# EAGLE design Solid State Timer v1.0 (EAGLE 7.7.0)

## Sheet 1 of 2
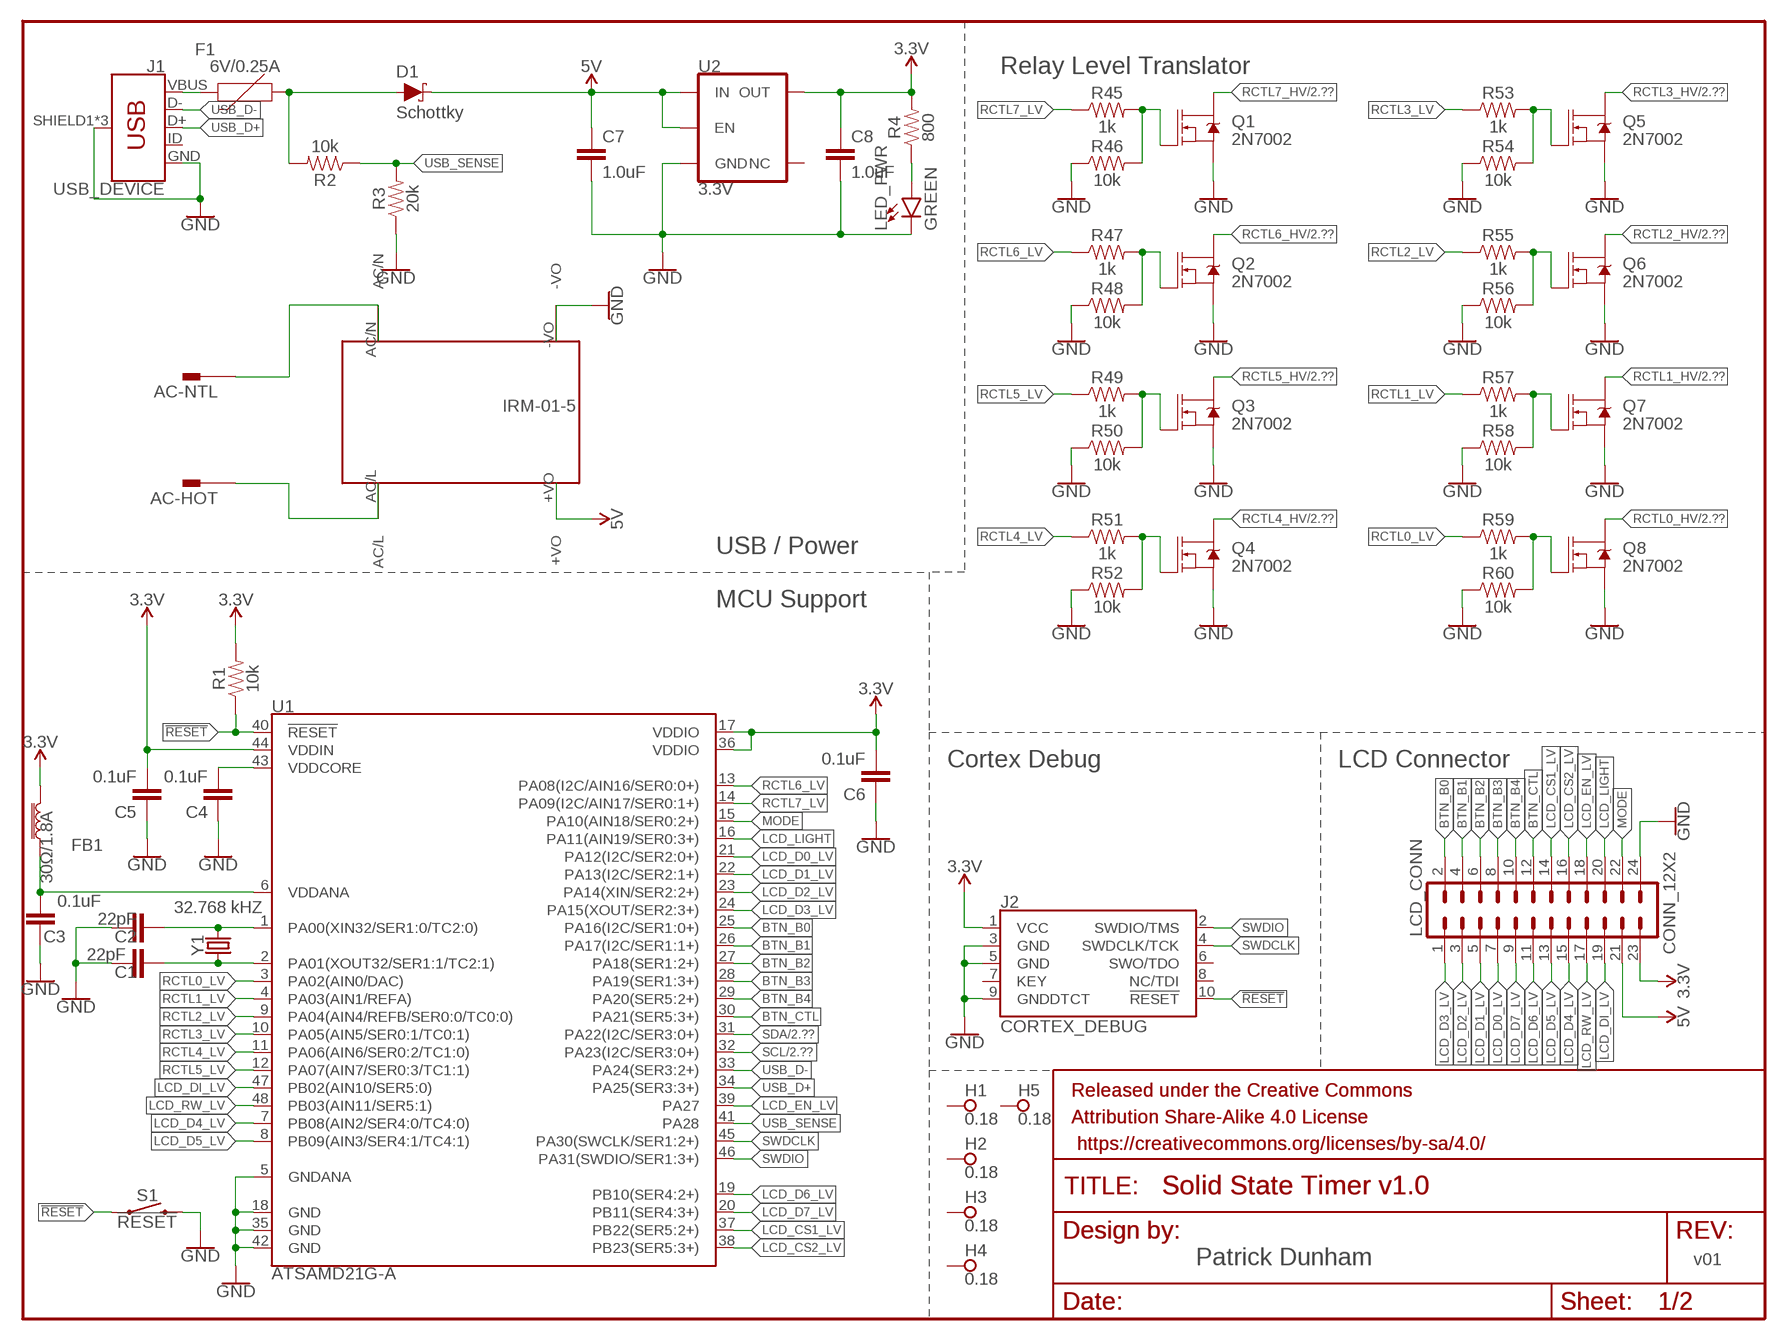
[diagram p0: schematic, sheet 1]

### Parts
AC-HOT  PIN262409-1  [62409-1]
AC-NTL  PIN262409-1  [62409-1]
C1  22pF  22PF-0603-50V-5%  [0603]
C2  22pF  22PF-0603-50V-5%  [0603]
C3  0.1uF  0.1UF-0603-25V-5%  [0603]
C4  0.1uF  0.1UF-0603-25V-5%  [0603]
C5  0.1uF  0.1UF-0603-25V-5%  [0603]
C6  0.1uF  0.1UF-0603-25V-5%  [0603]
C7  1.0uF  1.0UF-0603-16V-10%  [0603]
C8  1.0uF  1.0UF-0603-16V-10%  [0603]
D1  Schottky  DIODE-SCHOTTKY-ZLLS500  [SOT23-3]
F1  6V/0.25A  PPTC_THREE-QUARTER-AMP  [1206]
FB1  30Ω/1.8A  FERRITE_BEAD-0603  [0603]
FRAME1  FRAME-LETTERNO_PACKAGE  [DUMMY]
FRAME3  FRAME-LETTERNO_PACKAGE  [DUMMY]
H1  0.18  SPECIAL_DRILL_0.1800  [PAD_0.1800]
H2  0.18  SPECIAL_DRILL_0.1800  [PAD_0.1800]
H3  0.18  SPECIAL_DRILL_0.1800  [PAD_0.1800]
H4  0.18  SPECIAL_DRILL_0.1800  [PAD_0.1800]
H5  0.18  SPECIAL_DRILL_0.1800  [PAD_0.1800]
J1  USB_DEVICE  USB_MICRO-B_FEMALE-SMT  [USB-B-MICRO-SMD]
J2  CORTEX_DEBUG  CORTEX_DEBUG_PTH  [2X5-PTH-1.27MM]
LCD_CONN  CONN_12X2  [2X12]
LED_PWR  GREEN  LED0603  [LED-0603]
Q1  2N7002  MOSFET-NCH-2N7002PW  [SOT323]
Q2  2N7002  MOSFET-NCH-2N7002PW  [SOT323]
Q3  2N7002  MOSFET-NCH-2N7002PW  [SOT323]
Q4  2N7002  MOSFET-NCH-2N7002PW  [SOT323]
Q5  2N7002  MOSFET-NCH-2N7002PW  [SOT323]
Q6  2N7002  MOSFET-NCH-2N7002PW  [SOT323]
Q7  2N7002  MOSFET-NCH-2N7002PW  [SOT323]
Q8  2N7002  MOSFET-NCH-2N7002PW  [SOT323]
R1  10k  10KOHM-0603-1/10W-1%  [0603]
R2  10k  10KOHM-0603-1/10W-1%  [0603]
R3  20k  20KOHM-0603-1/10W-5%  [0603]
R4  800  330OHM-0603-1/10W-1%  [0603]
R45  1k  1KOHM-0603-1/10W-1%  [0603]
R46  10k  10KOHM-0603-1/10W-1%  [0603]
R47  1k  1KOHM-0603-1/10W-1%  [0603]
R48  10k  10KOHM-0603-1/10W-1%  [0603]
R49  1k  1KOHM-0603-1/10W-1%  [0603]
R50  10k  10KOHM-0603-1/10W-1%  [0603]
R51  1k  1KOHM-0603-1/10W-1%  [0603]
R52  10k  10KOHM-0603-1/10W-1%  [0603]
R53  1k  1KOHM-0603-1/10W-1%  [0603]
R54  10k  10KOHM-0603-1/10W-1%  [0603]
R55  1k  1KOHM-0603-1/10W-1%  [0603]
R56  10k  10KOHM-0603-1/10W-1%  [0603]
R57  1k  1KOHM-0603-1/10W-1%  [0603]
R58  10k  10KOHM-0603-1/10W-1%  [0603]
R59  1k  1KOHM-0603-1/10W-1%  [0603]
R60  10k  10KOHM-0603-1/10W-1%  [0603]
S1  !RESET  MOMENTARY-SWITCH-SPST-PTH-RIGHT-ANGLE-KIT  [TACTILE_SWITCH_PTH_RIGHT_ANGLE_KIT]
U1  ATSAMD21G-A  [TQFP-48]
U2  3.3V  V_REG_AP2112K-3.3V  [SOT23-5]
U$1  IRM-05-1  [IRM-01-5]
Y1  32.768 kHZ  CRYSTALSMD-3.2X1.5  [CRYSTAL-SMD-3.2X1.5MM]

### Nets
3.3V: C5.2 C6.2 C8.1 FB1.2 J2.1(VCC) LCD_CONN.23 R1.2 R4.2 U1.17(VDDIO) U1.36(VDDIO) U1.44(VDDIN) U2.5(OUT) ; also sheet 2
5V: C7.1 D1.3(C) LCD_CONN.21 U2.1(IN) U2.3(EN) U$1.+VO ; also sheet 2
!RESET: J2.10(!RESET) R1.1 S1.1 U1.40(!RESET!)
BTN_B0: LCD_CONN.2 U1.25(PA16(I2C/SER1:0+))
BTN_B1: LCD_CONN.4 U1.26(PA17(I2C/SER1:1+))
BTN_B2: LCD_CONN.6 U1.27(PA18(SER1:2+))
BTN_B3: LCD_CONN.8 U1.28(PA19(SER1:3+))
BTN_B4: LCD_CONN.10 U1.29(PA20(SER5:2+))
BTN_CTL: LCD_CONN.12 U1.30(PA21(SER5:3+))
GND: C1.1 C2.1 C3.1 C4.1 C5.1 C6.1 C7.2 C8.2 J1.GND J1.SHIELD1(SHIELD) J1.SHIELD2(SHIELD) J1.SHIELD3(SHIELD) J2.3(GND) J2.5(GND) J2.9(GNDDTCT) LCD_CONN.24 LED_PWR.C Q1.2(S) Q2.2(S) Q3.2(S) Q4.2(S) Q5.2(S) Q6.2(S) Q7.2(S) Q8.2(S) R3.1 R46.1 R48.1 R50.1 R52.1 R54.1 R56.1 R58.1 R60.1 S1.2 U1.5(GNDANA) U1.18(GND) U1.35(GND) U1.42(GND) U2.2(GND) U$1.-VO ; also sheet 2
LCD_CS1_LV: LCD_CONN.14 U1.37(PB22(SER5:2+))
LCD_CS2_LV: LCD_CONN.16 U1.38(PB23(SER5:3+))
LCD_D0_LV: LCD_CONN.7 U1.21(PA12(I2C/SER2:0+))
LCD_D1_LV: LCD_CONN.5 U1.22(PA13(I2C/SER2:1+))
LCD_D2_LV: LCD_CONN.3 U1.23(PA14(XIN/SER2:2+))
LCD_D3_LV: LCD_CONN.1 U1.24(PA15(XOUT/SER2:3+))
LCD_D4_LV: LCD_CONN.15 U1.7(PB08(AIN2/SER4:0/TC4:0))
LCD_D5_LV: LCD_CONN.13 U1.8(PB09(AIN3/SER4:1/TC4:1))
LCD_D6_LV: LCD_CONN.11 U1.19(PB10(SER4:2+))
LCD_D7_LV: LCD_CONN.9 U1.20(PB11(SER4:3+))
LCD_DI_LV: LCD_CONN.19 U1.47(PB02(AIN10/SER5:0))
LCD_EN_LV: LCD_CONN.18 U1.39(PA27)
LCD_LIGHT: LCD_CONN.20 U1.16(PA11(AIN19/SER0:3+))
LCD_RW_LV: LCD_CONN.17 U1.48(PB03(AIN11/SER5:1))
MODE: LCD_CONN.22 U1.15(PA10(AIN18/SER0:2+))
N$1: C2.2 U1.1(PA00(XIN32/SER1:0/TC2:0)) Y1.P$2
N$2: C1.2 U1.2(PA01(XOUT32/SER1:1/TC2:1)) Y1.P$1
N$3: C3.2 FB1.1 U1.6(VDDANA)
N$4: C4.2 U1.43(VDDCORE)
N$5: F1.2 J1.VBUS
N$6: AC-NTL.A1 AC-NTL.A2 U$1.AC/N
N$7: AC-HOT.A1 AC-HOT.A2 U$1.AC/L
N$9: LED_PWR.A R4.1
N$15: Q1.1(G) R45.2 R46.2
N$17: D1.1(A) F1.1 R2.2
N$44: Q2.1(G) R47.2 R48.2
N$67: Q3.1(G) R49.2 R50.2
N$68: Q4.1(G) R51.2 R52.2
N$69: Q5.1(G) R53.2 R54.2
N$70: Q6.1(G) R55.2 R56.2
N$71: Q7.1(G) R57.2 R58.2
N$72: Q8.1(G) R59.2 R60.2
RCTL0_HV: Q8.3(D) ; also sheet 2
RCTL0_LV: R59.1 U1.3(PA02(AIN0/DAC))
RCTL1_HV: Q7.3(D) ; also sheet 2
RCTL1_LV: R57.1 U1.4(PA03(AIN1/REFA))
RCTL2_HV: Q6.3(D) ; also sheet 2
RCTL2_LV: R55.1 U1.9(PA04(AIN4/REFB/SER0:0/TC0:0))
RCTL3_HV: Q5.3(D) ; also sheet 2
RCTL3_LV: R53.1 U1.10(PA05(AIN5/SER0:1/TC0:1))
RCTL4_HV: Q4.3(D) ; also sheet 2
RCTL4_LV: R51.1 U1.11(PA06(AIN6/SER0:2/TC1:0))
RCTL5_HV: Q3.3(D) ; also sheet 2
RCTL5_LV: R49.1 U1.12(PA07(AIN7/SER0:3/TC1:1))
RCTL6_HV: Q2.3(D) ; also sheet 2
RCTL6_LV: R47.1 U1.13(PA08(I2C/AIN16/SER0:0+))
RCTL7_HV: Q1.3(D) ; also sheet 2
RCTL7_LV: R45.1 U1.14(PA09(I2C/AIN17/SER0:1+))
SCL: U1.32(PA23(I2C/SER3:0+)) ; also sheet 2
SDA: U1.31(PA22(I2C/SER3:0+)) ; also sheet 2
SWDCLK: J2.4(SWDCLK/TCK) U1.45(PA30(SWCLK/SER1:2+))
SWDIO: J2.2(SWDIO/TMS) U1.46(PA31(SWDIO/SER1:3+))
USB_D+: J1.D+ U1.34(PA25(SER3:3+))
USB_D-: J1.D- U1.33(PA24(SER3:2+))
USB_SENSE: R2.1 R3.2 U1.41(PA28)
Unconnected: H1.1 H2.1 H3.1 H4.1 H5.1 J1.ID J2.6(SWO/TDO) J2.7(KEY) J2.8(NC/TDI) U2.4(NC)

### Notes on the sheet
- Relay Level Translator
- USB / Power
- MCU Support
- Cortex Debug | LCD Connector

## Sheet 2 of 2
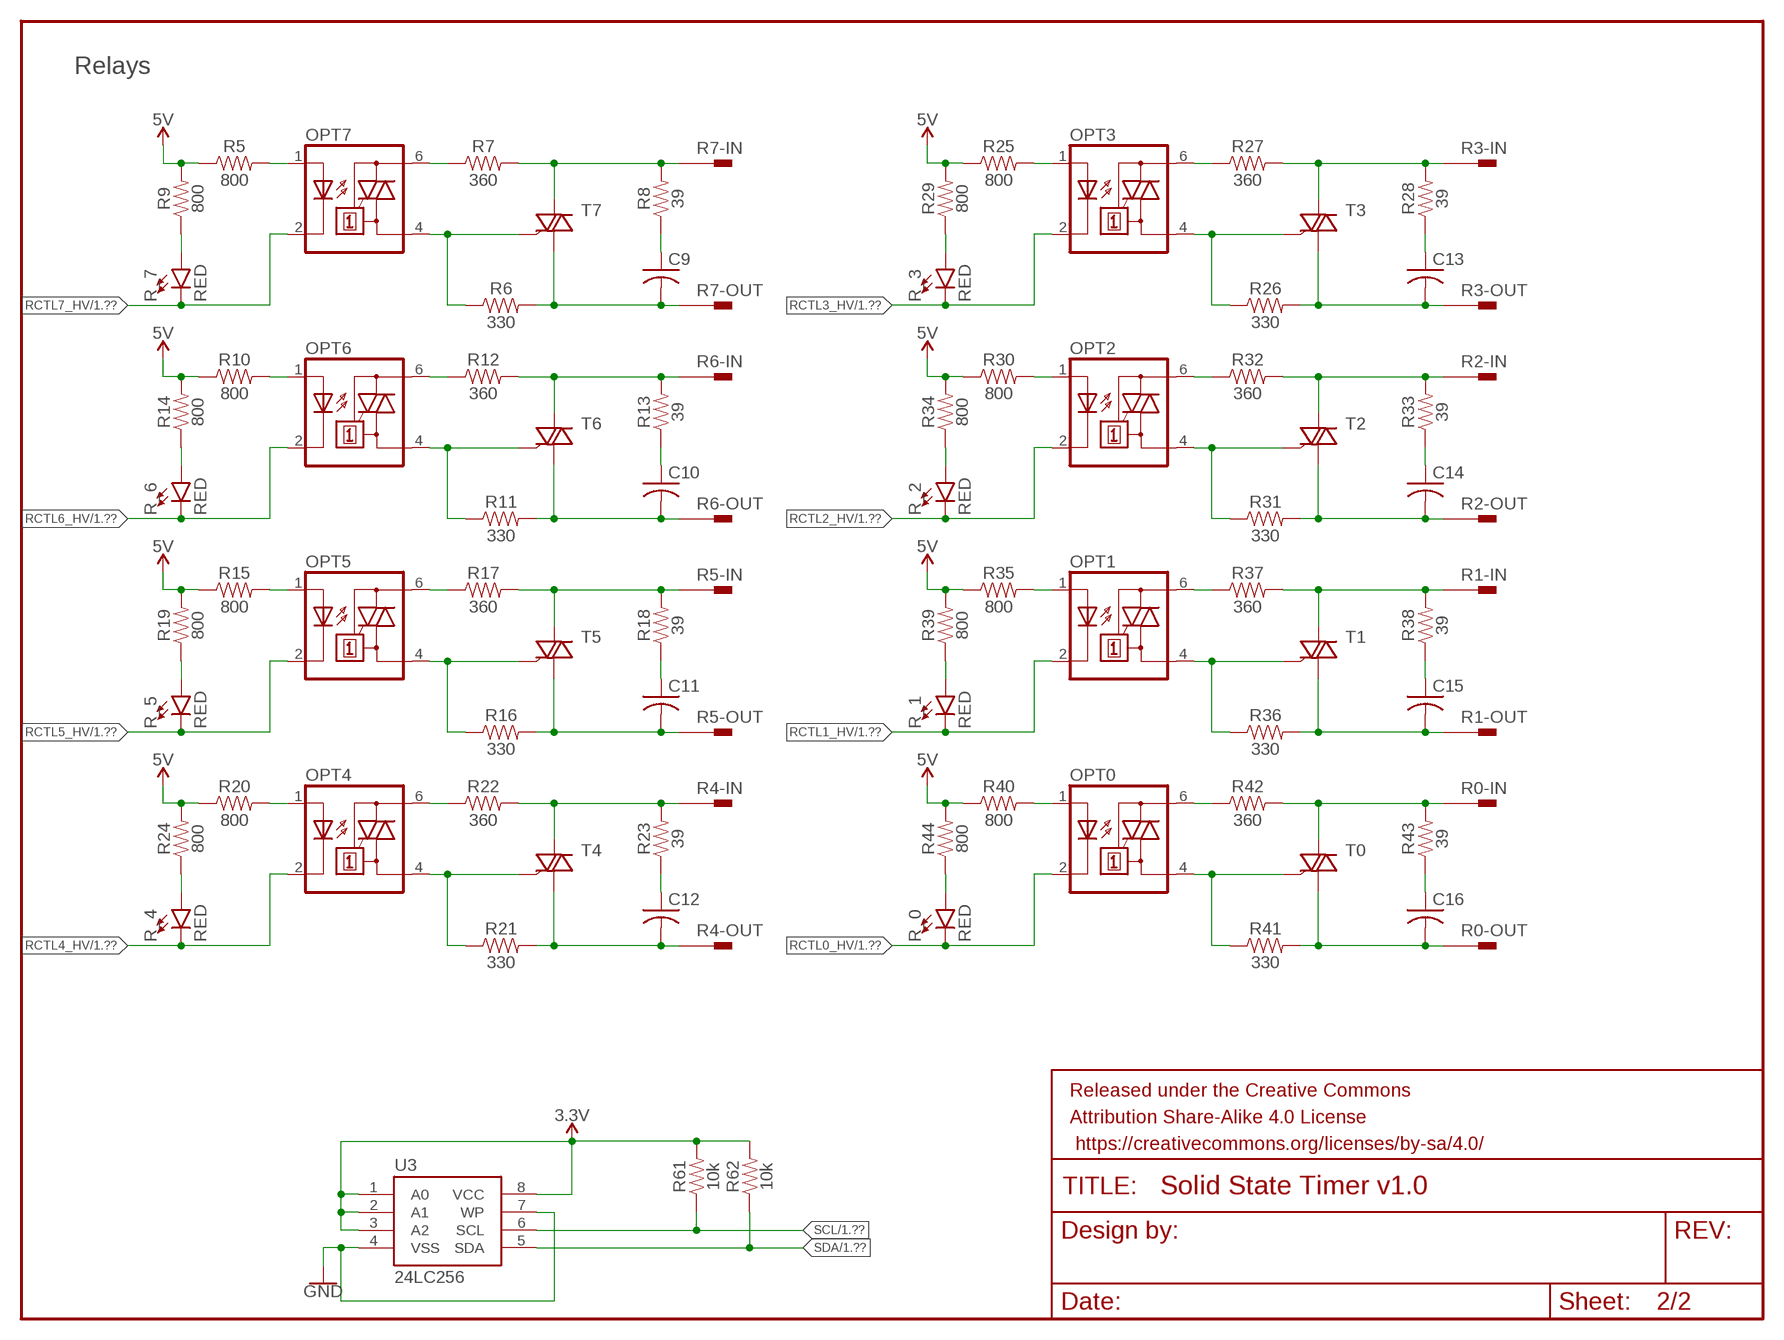
[diagram p1: schematic, sheet 2]

### Parts
C9  C-USC1206  [C1206]
C10  C-USC1206  [C1206]
C11  C-USC1206  [C1206]
C12  C-USC1206  [C1206]
C13  C-USC1206  [C1206]
C14  C-USC1206  [C1206]
C15  C-USC1206  [C1206]
C16  C-USC1206  [C1206]
FRAME2  FRAME-LETTERNO_PACKAGE  [DUMMY]
OPT0  MOC3031M  [DIL06]
OPT1  MOC3031M  [DIL06]
OPT2  MOC3031M  [DIL06]
OPT3  MOC3031M  [DIL06]
OPT4  MOC3031M  [DIL06]
OPT5  MOC3031M  [DIL06]
OPT6  MOC3031M  [DIL06]
OPT7  MOC3031M  [DIL06]
R0-IN  PIN262409-1  [62409-1]
R0-OUT  PIN262409-1  [62409-1]
R1-IN  PIN262409-1  [62409-1]
R1-OUT  PIN262409-1  [62409-1]
R2-IN  PIN262409-1  [62409-1]
R2-OUT  PIN262409-1  [62409-1]
R3-IN  PIN262409-1  [62409-1]
R3-OUT  PIN262409-1  [62409-1]
R4-IN  PIN262409-1  [62409-1]
R4-OUT  PIN262409-1  [62409-1]
R5  800  180OHM-0603-1/10W-1%  [0603]
R5-IN  PIN262409-1  [62409-1]
R5-OUT  PIN262409-1  [62409-1]
R6  330  330OHM-0603-1/10W-1%  [0603]
R6-IN  PIN262409-1  [62409-1]
R6-OUT  PIN262409-1  [62409-1]
R7  360  390OHM-0603-1/10W-1%  [0603]
R7-IN  PIN262409-1  [62409-1]
R7-OUT  PIN262409-1  [62409-1]
R8  39  39KOHM-0603-1/10W-1%  [0603]
R9  800  680OHM-0603-1/10W-5%  [0603]
R10  800  180OHM-0603-1/10W-1%  [0603]
R11  330  330OHM-0603-1/10W-1%  [0603]
R12  360  390OHM-0603-1/10W-1%  [0603]
R13  39  39KOHM-0603-1/10W-1%  [0603]
R14  800  680OHM-0603-1/10W-5%  [0603]
R15  800  180OHM-0603-1/10W-1%  [0603]
R16  330  330OHM-0603-1/10W-1%  [0603]
R17  360  390OHM-0603-1/10W-1%  [0603]
R18  39  39KOHM-0603-1/10W-1%  [0603]
R19  800  680OHM-0603-1/10W-5%  [0603]
R20  800  180OHM-0603-1/10W-1%  [0603]
R21  330  330OHM-0603-1/10W-1%  [0603]
R22  360  390OHM-0603-1/10W-1%  [0603]
R23  39  39KOHM-0603-1/10W-1%  [0603]
R24  800  680OHM-0603-1/10W-5%  [0603]
R25  800  180OHM-0603-1/10W-1%  [0603]
R26  330  330OHM-0603-1/10W-1%  [0603]
R27  360  390OHM-0603-1/10W-1%  [0603]
R28  39  39KOHM-0603-1/10W-1%  [0603]
R29  800  680OHM-0603-1/10W-5%  [0603]
R30  800  180OHM-0603-1/10W-1%  [0603]
R31  330  330OHM-0603-1/10W-1%  [0603]
R32  360  390OHM-0603-1/10W-1%  [0603]
R33  39  39KOHM-0603-1/10W-1%  [0603]
R34  800  680OHM-0603-1/10W-5%  [0603]
R35  800  180OHM-0603-1/10W-1%  [0603]
R36  330  330OHM-0603-1/10W-1%  [0603]
R37  360  390OHM-0603-1/10W-1%  [0603]
R38  39  39KOHM-0603-1/10W-1%  [0603]
R39  800  680OHM-0603-1/10W-5%  [0603]
R40  800  180OHM-0603-1/10W-1%  [0603]
R41  330  330OHM-0603-1/10W-1%  [0603]
R42  360  390OHM-0603-1/10W-1%  [0603]
R43  39  39KOHM-0603-1/10W-1%  [0603]
R44  800  680OHM-0603-1/10W-5%  [0603]
R61  10k  10KOHM-0603-1/10W-1%  [0603]
R62  10k  10KOHM-0603-1/10W-1%  [0603]
R_0  RED  LED-RED0603  [LED-0603]
R_1  RED  LED-RED0603  [LED-0603]
R_2  RED  LED-RED0603  [LED-0603]
R_3  RED  LED-RED0603  [LED-0603]
R_4  RED  LED-RED0603  [LED-0603]
R_5  RED  LED-RED0603  [LED-0603]
R_6  RED  LED-RED0603  [LED-0603]
R_7  RED  LED-RED0603  [LED-0603]
T0  BT138-V  [TO220BV]
T1  BT138-V  [TO220BV]
T2  BT138-V  [TO220BV]
T3  BT138-V  [TO220BV]
T4  BT138-V  [TO220BV]
T5  BT138-V  [TO220BV]
T6  BT138-V  [TO220BV]
T7  BT138-V  [TO220BV]
U3  24LC256  EEPROM-I2CSMD  [SO08]

### Nets
3.3V: R61.2 R62.2 U3.1(A0) U3.2(A1) U3.3(A2) U3.8(VCC) ; also sheet 1
5V: R5.1 R9.2 R10.1 R14.2 R15.1 R19.2 R20.1 R24.2 R25.1 R29.2 R30.1 R34.2 R35.1 R39.2 R40.1 R44.2 ; also sheet 1
GND: U3.4(VSS) U3.7(WP) ; also sheet 1
N$8: OPT7.1(A) R5.2
N$10: OPT7.4(A1) R6.1 T7.G
N$11: OPT7.6(A2) R7.1
N$12: R7-IN.A1 R7-IN.A2 R7.2 R8.2 T7.T2(A2)
N$13: C9.1 R8.1
N$14: C9.2 R6.2 R7-OUT.A1 R7-OUT.A2 T7.T1(A1)
N$16: R9.1 R_7.A
N$18: OPT6.1(A) R10.2
N$19: OPT6.4(A1) R11.1 T6.G
N$20: OPT6.6(A2) R12.1
N$21: R6-IN.A1 R6-IN.A2 R12.2 R13.2 T6.T2(A2)
N$22: C10.1 R13.1
N$23: C10.2 R6-OUT.A1 R6-OUT.A2 R11.2 T6.T1(A1)
N$24: R14.1 R_6.A
N$25: OPT5.1(A) R15.2
N$26: OPT5.4(A1) R16.1 T5.G
N$27: OPT5.6(A2) R17.1
N$28: R5-IN.A1 R5-IN.A2 R17.2 R18.2 T5.T2(A2)
N$29: C11.1 R18.1
N$30: C11.2 R5-OUT.A1 R5-OUT.A2 R16.2 T5.T1(A1)
N$31: R19.1 R_5.A
N$32: OPT4.1(A) R20.2
N$33: OPT4.4(A1) R21.1 T4.G
N$34: OPT4.6(A2) R22.1
N$35: R4-IN.A1 R4-IN.A2 R22.2 R23.2 T4.T2(A2)
N$36: C12.1 R23.1
N$37: C12.2 R4-OUT.A1 R4-OUT.A2 R21.2 T4.T1(A1)
N$38: R24.1 R_4.A
N$39: OPT3.1(A) R25.2
N$40: OPT3.4(A1) R26.1 T3.G
N$41: OPT3.6(A2) R27.1
N$42: R3-IN.A1 R3-IN.A2 R27.2 R28.2 T3.T2(A2)
N$43: C13.1 R28.1
N$45: R29.1 R_3.A
N$46: OPT2.1(A) R30.2
N$47: OPT2.4(A1) R31.1 T2.G
N$48: OPT2.6(A2) R32.1
N$49: R2-IN.A1 R2-IN.A2 R32.2 R33.2 T2.T2(A2)
N$50: C14.1 R33.1
N$51: C14.2 R2-OUT.A1 R2-OUT.A2 R31.2 T2.T1(A1)
N$52: R34.1 R_2.A
N$53: OPT1.1(A) R35.2
N$54: OPT1.4(A1) R36.1 T1.G
N$55: OPT1.6(A2) R37.1
N$56: R1-IN.A1 R1-IN.A2 R37.2 R38.2 T1.T2(A2)
N$57: C15.1 R38.1
N$58: C15.2 R1-OUT.A1 R1-OUT.A2 R36.2 T1.T1(A1)
N$59: R39.1 R_1.A
N$60: OPT0.1(A) R40.2
N$61: OPT0.4(A1) R41.1 T0.G
N$62: OPT0.6(A2) R42.1
N$63: R0-IN.A1 R0-IN.A2 R42.2 R43.2 T0.T2(A2)
N$64: C16.1 R43.1
N$65: C16.2 R0-OUT.A1 R0-OUT.A2 R41.2 T0.T1(A1)
N$66: R44.1 R_0.A
R3-OUT: C13.2 R3-OUT.A1 R3-OUT.A2 R26.2 T3.T1(A1)
RCTL0_HV: OPT0.2(C) R_0.C ; also sheet 1
RCTL1_HV: OPT1.2(C) R_1.C ; also sheet 1
RCTL2_HV: OPT2.2(C) R_2.C ; also sheet 1
RCTL3_HV: OPT3.2(C) R_3.C ; also sheet 1
RCTL4_HV: OPT4.2(C) R_4.C ; also sheet 1
RCTL5_HV: OPT5.2(C) R_5.C ; also sheet 1
RCTL6_HV: OPT6.2(C) R_6.C ; also sheet 1
RCTL7_HV: OPT7.2(C) R_7.C ; also sheet 1
SCL: R61.1 U3.6(SCL) ; also sheet 1
SDA: R62.1 U3.5(SDA) ; also sheet 1

### Notes on the sheet
- Relays

## Library data of the parts
AC-HOT AC-NTL R0-IN R0-OUT R1-IN R1-OUT R2-IN R2-OUT R3-IN R3-OUT R4-IN R4-OUT R5-IN R5-OUT R6-IN R6-OUT R7-IN R7-OUT = con-faston:PIN2: Flachstecker Typ Tyco/Electronics/AMP TAB, FASTON Printed Circuit Board Tabs Source: http://www.buerklin.com, http://catalog.tycoelectronics.com; OC_FARNELL: unknown; OC_NEWARK: unknown
C1 C2 = SparkFun-Capacitors:22PF: 22pF ceramic capacitors A capacitor is a passive two-terminal electrical component used to store electrical energy temporarily in an electric field.; PROD_ID: CAP-07876
C3-C6 = SparkFun-Capacitors:0.1UF: 0.1µF ceramic capacitors A capacitor is a passive two-terminal electrical component used to store electrical energy temporarily in an electric field.; PROD_ID: CAP-08604
C7 C8 = SparkFun-Capacitors:1.0UF: 1µF ceramic capacitors A capacitor is a passive two-terminal electrical component used to store electrical energy temporarily in an electric field.; PROD_ID: CAP-00868
C9-C16 = rcl:C-US: CAPACITOR, American symbol
D1 = SparkFun-DiscreteSemi:DIODE-SCHOTTKY: Schottky diode A Schottky diode is a semiconductor diode which has a low forward voltage drop and a very fast switching action.; PROD_ID: DIO-08411; VALUE: 700mA/40V/533mV
F1 = SparkFun-Fuses:PPTC: Resettable Fuse PPTC Resettable Fuse. Really a sort of resistor with a polymeric positive temperature coefficient whose resistance increases dramatically with an increase in temperature. When heated by the power passing through the resistance rises causing the current to be limited, protecting the circuit. This is achieved by the transition of the polymer from a crystalline to an amorphous state where the conductive carbon separates breaking the conductive pathways found in the cool crystalline structure. When a PPTC cools back down it resumes conducting letting the circuit turn back on. SparkFun Products: SparkFun RedBoard - Programmed with Arduino <https://www.sparkfun.com/products/12757> Pro Micro - 5V/16MHz <https://www.sparkfun.com/products/12640> Arduino Pro 328 - 5V/16MHz <https://www.sparkfun.com/products/10915> MP3 Trigger <https://www.sparkfun.com/products/13720>; PROD_ID: RES-11150; VALUE: 6V/0.75A
FB1 = SparkFun-Coils:FERRITE_BEAD: Ferrite Bead (blocks, cores, rings, chokes, etc.) Inductor with layers of ferrite used to suppress high frequencies. Often used to isolate high frequency noise. SparkFun Products: IOIO-OTG - V2.2 <https://www.sparkfun.com/products/13613> SparkFun SAMD21 Mini Breakout <https://www.sparkfun.com/products/13664> SparkFun 6 Degrees of Freedom Breakout - LSM6DS3 <https://www.sparkfun.com/products/13339> SparkFun SAMD21 Dev Breakout <https://www.sparkfun.com/products/13672>; PROD_ID: NDUC-07859
FRAME1 FRAME2 = SparkFun-Aesthetics:FRAME-LETTER: Schematic Frame - Letter Standard 8.5x11 US Letter frame; DESIGNER: Nobody; VERSION: v01
FRAME3 = SparkFun-Aesthetics:FRAME-LETTER: Schematic Frame - Letter Standard 8.5x11 US Letter frame; DESIGNER: Patrick Dunham; VERSION: v01
H1-H5 = special-drill:SPECIAL_DRILL_: Special drills
J1 = SparkFun-Connectors:USB_MICRO-B: USB Type Micro-B Connector Male/female and PTH/SMT variants SparkFun Products: SparkFun microB USB Breakout <https://www.sparkfun.com/products/12035> SparkFun USB microB Plug Breakout <https://www.sparkfun.com/products/10031> SparkFun ESP8266 Thing <https://www.sparkfun.com/products/13231>; PROD_ID: CONN-11752
J2 = SparkFun-Connectors:CORTEX_DEBUG: Cortex Debug Connector - 10 pin Supports JTAG debug, Serial Wire debug, and Serial Wire Viewer. PTH and SMD connector options available. General Connector Information <http://infocenter.arm.com/help/topic/com.arm.doc.faqs/attached/13634/cortex_debug_connectors.pdf> Products: PTH Connector <http://www.digikey.com/product-detail/en/cnc-tech/3220-10-0100-00/1175-1627-ND/3883661> -via Digi-Key SparkFun PSoc <https://www.sparkfun.com/products/13229> SparkFun T <https://www.sparkfun.com/products/13810>
LCD_CONN = SparkFun-Connectors:CONN_12X2: Multi connection point. Often used as Generic Header-pin footprint for 0.1 inch spaced/style header connections On any of the 0.1 inch spaced packages, you can populate with these: Break Away Headers - Straight <https://www.sparkfun.com/products/116> (PRT-00116) Break Away Male Headers - Right Angle <https://www.sparkfun.com/products/553> (PRT-00553) Female Headers <https://www.sparkfun.com/products/115> (PRT-00115) Break Away Headers - Machine Pin <https://www.sparkfun.com/products/117> (PRT-00117) Break Away Female Headers - Swiss Machine Pin <https://www.sparkfun.com/products/743> (PRT-00743)
LED_PWR = SparkFun-LED:LED: LED (Generic) Standard schematic elements and footprints for 5mm, 3mm, 1206, and 0603 sized LEDs. Generic LEDs with no color specified.
OPT0 OPT1-OPT7 = optocoupler:MOC30*: 6-Pin DIP Zero-Cross Optoisolators Triac Driver Output (250/400 Volt Peak) Source: Data sheet <http://www.fairchildsemi.com/ds/MO/MOC3031M.pdf> The old path of data sheet not more available 2013-05-06.; MF: FAIRCHILD SEMICONDUCTOR; MPN: MOC3031M; OC_FARNELL: 9875964; OC_NEWARK: 78K6089
Q1-Q8 = SparkFun-DiscreteSemi:MOSFET-NCH: N-channel MOSFETs Voltage controlled devices that allow control of high current outputs. SparkFun Products: SparkFun OpenScale <https://www.sparkfun.com/products/13261> SparkFun Digital Sandbox <https://www.sparkfun.com/products/12651> SparkFun Monster Moto Shield <https://www.sparkfun.com/products/10182> SparkFun MOSFET Power Controller <https://www.sparkfun.com/products/11214>; PROD_ID: TRANS-11151; VALUE: 310mA/60V/1.6Ω
R1 R2 R46 R48 R50 R52 R54 R56 R58 R60-R62 = SparkFun-Resistors:10KOHM: 10kΩ resistor A resistor is a passive two-terminal electrical component that implements electrical resistance as a circuit element. Resistors act to reduce current flow, and, at the same time, act to lower voltage levels within circuits. - Wikipedia; PROD_ID: RES-00824
R3 = SparkFun-Resistors:20KOHM: 20kΩ resistor A resistor is a passive two-terminal electrical component that implements electrical resistance as a circuit element. Resistors act to reduce current flow, and, at the same time, act to lower voltage levels within circuits. - Wikipedia; PROD_ID: RES-09231
R4 = SparkFun-Resistors:330OHM: 330Ω resistor A resistor is a passive two-terminal electrical component that implements electrical resistance as a circuit element. Resistors act to reduce current flow, and, at the same time, act to lower voltage levels within circuits. - Wikipedia; PROD_ID: RES-00818; VALUE: 330
R5 R10 R15 R20 R25 R30 R35 R40 = SparkFun-Resistors:180OHM: 180Ω resistor A resistor is a passive two-terminal electrical component that implements electrical resistance as a circuit element. Resistors act to reduce current flow, and, at the same time, act to lower voltage levels within circuits. - Wikipedia; PROD_ID: RES-08788; VALUE: 180
R6 R11 R16 R21 R26 R31 R36 R41 = SparkFun-Resistors:330OHM: 330Ω resistor A resistor is a passive two-terminal electrical component that implements electrical resistance as a circuit element. Resistors act to reduce current flow, and, at the same time, act to lower voltage levels within circuits. - Wikipedia; PROD_ID: RES-00818
R7 R12 R17 R22 R27 R32 R37 R42 = SparkFun-Resistors:390OHM: 390Ω resistor A resistor is a passive two-terminal electrical component that implements electrical resistance as a circuit element. Resistors act to reduce current flow, and, at the same time, act to lower voltage levels within circuits. - Wikipedia; PROD_ID: RES-07864; VALUE: 390
R8 R13 R18 R23 R28 R33 R38 R43 = SparkFun-Resistors:39KOHM: 39kΩ resistor A resistor is a passive two-terminal electrical component that implements electrical resistance as a circuit element. Resistors act to reduce current flow, and, at the same time, act to lower voltage levels within circuits. - Wikipedia; PROD_ID: RES-12377; VALUE: 39k
R9 R14 R19 R24 R29 R34 R39 R44 = SparkFun-Resistors:680OHM: 680Ω resistor A resistor is a passive two-terminal electrical component that implements electrical resistance as a circuit element. Resistors act to reduce current flow, and, at the same time, act to lower voltage levels within circuits. - Wikipedia; PROD_ID: RES-09333; VALUE: 680
R45 R47 R49 R51 R53 R55 R57 R59 = SparkFun-Resistors:1KOHM: 1kΩ resistor A resistor is a passive two-terminal electrical component that implements electrical resistance as a circuit element. Resistors act to reduce current flow, and, at the same time, act to lower voltage levels within circuits. - Wikipedia; PROD_ID: RES-07856
R_0 R_1-R_7 = SparkFun-LED:LED-RED: Red SMD LED Used in manufacturing of most products at SparkFun Packages: 0603 - SMD 0603 package [Product Link] <http://docs.avagotech.com/docs/AV02-0551EN> 0603 SMART - SMD 0603 SMART package ( more efficient and expensive)[Product Link] <http://www.osram-os.com/Graphics/XPic2/00077099_0.pdf> 1206 - SMD1206 package [Product Link] <https://www.sparkfun.com/datasheets/DevTools/LilyPad/Q150OVS4.pdff> SparkFun Products: Pro Mini 328 -5V <https://www.sparkfun.com/products/821> RedBoard <https://www.sparkfun.com/products/12757> IOIO-OTG <https://www.sparkfun.com/products/13613>; PROD_ID: DIO-00819
S1 = SparkFun-Switches:MOMENTARY-SWITCH-SPST: Momentary Switch (Pushbutton) - SPST Normally-open (NO) SPST momentary switches (buttons, pushbuttons). Variants PTH-12MM - 12mm square, through-hole Momentary Pushbutton Switch - 12mm Square <https://www.sparkfun.com/products/9190> (COM-09190) PTH-6.0MM, PTH-6.0MM-KIT - 6.0mm square, through-hole Mini Pushbutton Switch <https://www.sparkfun.com/products/97> (COM-00097) KIT package intended for soldering kit's - only one side of pads' copper is exposed. PTH-RIGHT-ANGLE-KIT - Right-angle, through-hole Right Angle Tactile Button <https://www.sparkfun.com/products/10791> - Used on SparkFun BigTime Watch Kit <https://www.sparkfun.com/products/11734> SMD-12MM - 12mm square, surface-mount Tactile Button - SMD (12mm) <https://www.sparkfun.com/products/12993> (COM-12993) Used on SparkFun PicoBoard <https://www.sparkfun.com/products/11888> SMD-4.5MM - 4.5mm Square Trackball Switch Used on SparkFun Blackberry Trackballer Breakout <https://www.sparkfun.com/products/13169> SMD-4.6MMX2.8MM - 4.60mm x 2.80mm, surface mount Used on SparkFun SAMD21 Mini Breakout <https://www.sparkfun.com/products/13664> SMD-5.2MM, SMD-5.2-REDUNDANT - 5.2mm square, surface-mount Mini Pushbutton Switch - SMD <https://www.sparkfun.com/products/8720> (COM-08720) Used on Arduino Pro Mini <https://www.sparkfun.com/products/11114> REDUNDANT package connects both switch circuits together SMD-6.0X3.5MM - 6.0 x 3.5mm, surface mount Momentary Reset Switch SMD <https://www.sparkfun.com/products/8229> (COM-08229) SMD-6.2MM-TALL - 6.2mm square, surface mount Tactile Button - SMD (6mm) <https://www.sparkfun.com/products/12992> Used on SparkFun Digital Sandbox <https://www.sparkfun.com/products/12651> SMD-RIGHT-ANGLE - Right-angle, surface mount Used on SparkFun Block for Intel® Edison - Arduino <https://www.sparkfun.com/products/13036>; PROD_ID: CONN-10672; SF_SKU: COM-10791
T0 T1-T7 = triac:BT138: TRIAC Source: http://www.semiconductors.philips.com BT138_SERIES_2.pdf
U1 = SparkFun-IC-Microcontroller:ATSAMD21G: Atmel SAMD21G SMART ARM-Based Microcontroller The Atmel ® | SMART ™ SAM D21 is a series of low-power microcontrollers using the 32-bit ARM ® Cortex ® -M0+ processor, and ranging from 32- to 64-pins with up to 256KB Flash and 32KB of SRAM. The SAM D21 devices operate at a maximum frequency of 48MHz and reach 2.46 CoreMark/MHz. They are designed for simple and intuitive migration with identical peripheral modules, hex compatible code, identical linear address map and pin compatible migration paths between all devices in the product series. All devices include intelligent and flexible peripherals, Atmel Event System for inter-peripheral signaling, and support for capacitive touch button, slider and wheel user interfaces. Datasheet <https://cdn.sparkfun.com/datasheets/Dev/Arduino/Boards/Atmel-42181-SAM-D21_Datasheet.pdf> SparkFun Products SparkFun SAMD21 Mini Breakout <https://www.sparkfun.com/products/13664> (DEV-13664) SparkFun SAMD21 Dev Breakout <https://www.sparkfun.com/products/13672> (DEV-13672); PROD_ID: IC-13064
U2 = SparkFun-IC-Power:V_REG_AP2112: AP2112 - 600mA CMOS LDO Regulator w/ Enable The AP2112 is CMOS process low dropout linear regulator with enable function, the regulator delivers a guaranteed 600mA (min.) continuous load current. Features Output Voltage Accuracy: ±1.5% Output Current: 600mA (Min.) Foldback Short Current Protection: 50mA Enable Function to Turn ON/OFF VOUT Low Dropout Voltage (3.3V): 250mV (Typ.) @IOUT=600mA Excellent Load Regulation: 0.2%/A (Typ.) Excellent Line Regulation: 0.02%/V (Typ.) Low Quiescent Current: 55μA (Typ.) Low Standby Current: 0.01μA (Typ.) Low Output Noise: 50μVRMS PSRR: 100Hz -65dB, 1kHz -65dB OTSD Protection Stable with 1.0μF Flexible Cap: Ceramic, Tantalum and Aluminum Electrolytic Operation Temperature Range: -40°C to 85°C ESD: MM 400V, HBM 4000V; PROD_ID: VREG-12457
U3 = SparkFun-IC-Memory:EEPROM-I2C: I2C EEPROMs, 24LC256 and others 24LC256 Series 256 kb I2C 2 Wire (32 k x 8 Bit) 2.5 V Serial EEPROM SMD - SOIC-8 Datasheet SparkFun Products SparkFun UDB5 - PIC UAV Development Board <https://www.sparkfun.com/products/11703> (GPS-11703); PROD_ID: IC-09714
U$1 = IRM-01-5:IRM-05-1
Y1 = SparkFun-Clocks:CRYSTAL: Crystals (Generic) These are passive quartz crystals, which can be used as a clock source for a microcontroller. Crystal's are two-terminal devices. They require external "load" capacitors to generate an oscillating signal.

## Board
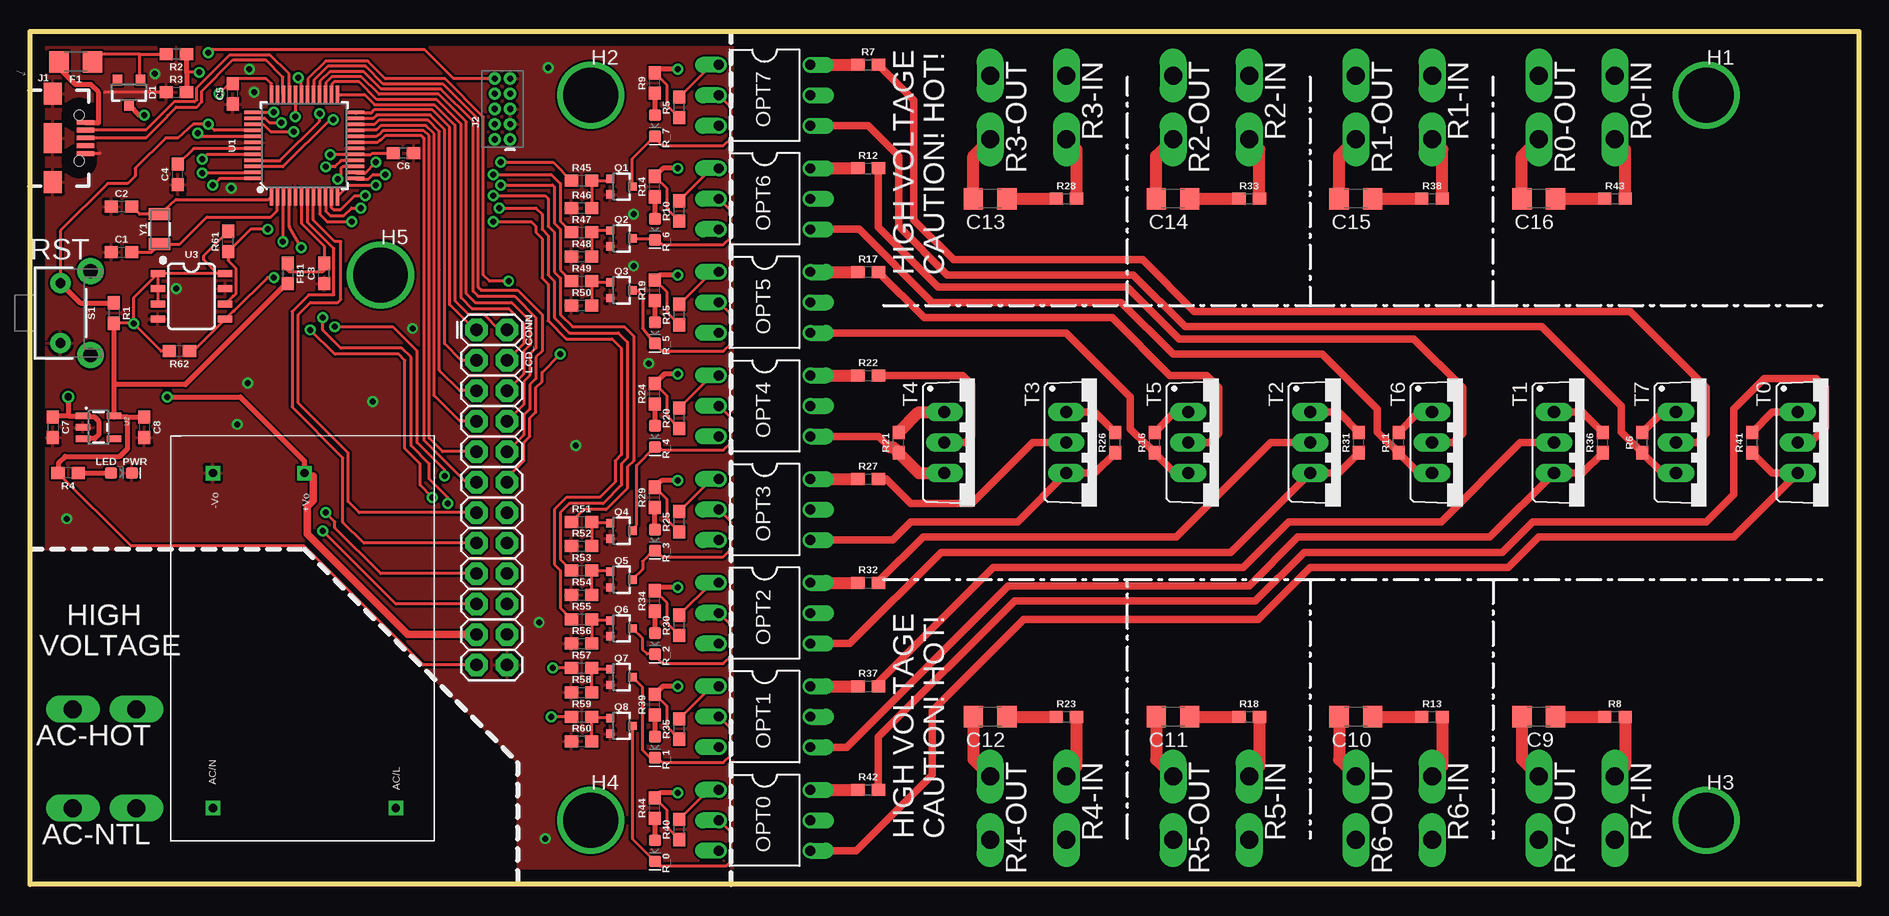
[diagram p2: board, top side]
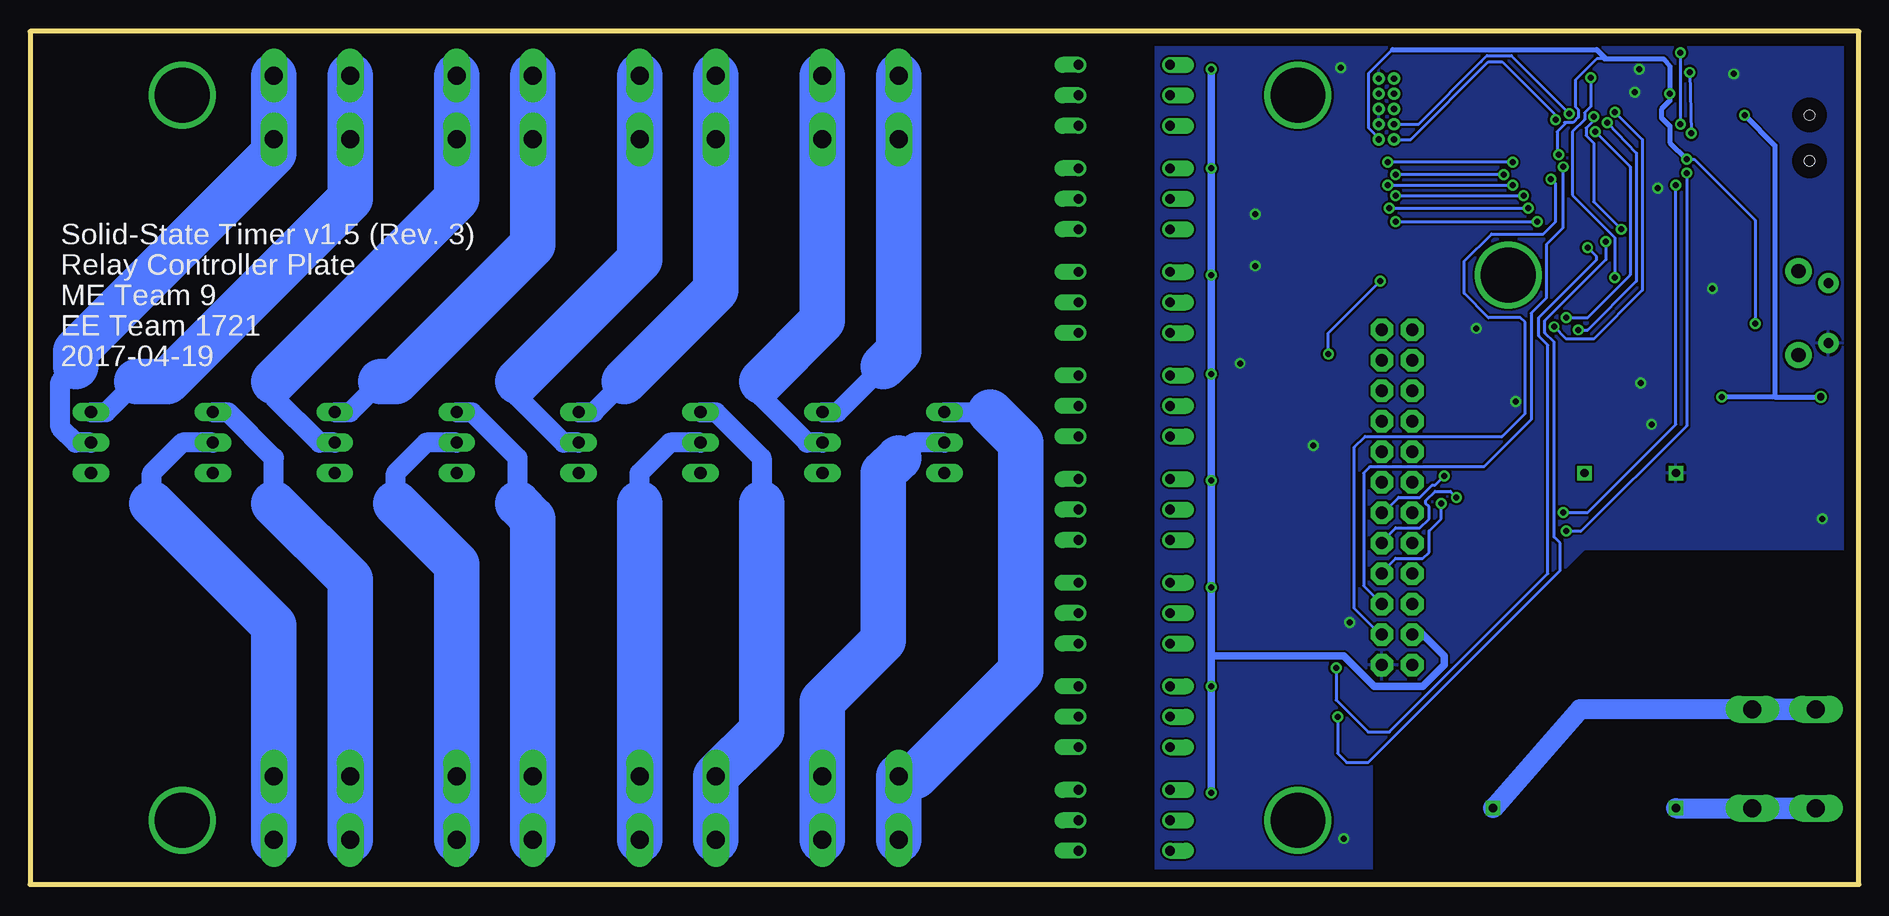
[diagram p3: board, bottom side, seen from below]

Size 152.4 x 71.12 mm. Coordinates in mm from the lower left corner, seen from the top.
Outline: 0,0 0,71.12 152.4,71.12 152.4,0 0,0
Copper layers (1*16): Top 0.035mm / dielectric 1.5mm / Bottom 0.035mm
Design rules "default *": minimum track width 10mil, minimum drill 19mil, track to track 7mil, track to pad 7mil, pad to pad 7mil, via to via 7mil, smd to smd 7mil, copper to edge 40mil, drill to drill 8mil, minimum pad ring 10mil, minimum via ring 8mil, stop-mask expansion 4mil, vias tented up to drill 0mil, thermal gap 10mil

### Footprints (pad centres in the part's own frame; a part is rotated, then mirrored left to right if it is on the bottom)
62409-1 = drill 1.5 pad 1.9 long: A1 -2.65,0; A2 2.65,0
0603 = smd 1.1 x 1: 1 -0.85,0; 2 0.85,0
C1206 = smd 1.6 x 1.8: 1 -1.4,0; 2 1.4,0
SOT23-3 = smd 0.8 x 0.9: 1 -0.95,-1; 2 0.95,-1; 3 0,1.1
1206 = smd 1.6 x 1.8: 1 -1.4,0; 2 1.4,0
PAD_0.1800 = drill 4.572 pad 4.572: 1 0,0
USB-B-MICRO-SMD = smd 1.45 x 0.4: D+ 2.725,0; D- 2.725,0.65; GND 2.725,-1.3; ID 2.725,-0.65; VBUS 2.725,1.3 | smd 1.5 x 1.8: SHIELD1 0,3.685; SHIELD2 0,-3.685 | smd 1.5 x 2.5: SHIELD3 0,0 | hole 0.85: 2.2,1.9; 2.2,-1.9
2X5-PTH-1.27MM = drill 0.508 pad 1: 1 -2.54,-0.635; 2 -2.54,0.635; 3 -1.27,-0.635; 4 -1.27,0.635; 5 0,-0.635; 6 0,0.635; 7 1.27,-0.635; 8 1.27,0.635; 9 2.54,-0.635; 10 2.54,0.635
2X12 = drill 1.016 pad 1.88 octagon: 1 0,0; 2 0,2.54; 3 2.54,0; 4 2.54,2.54; 5 5.08,0; 6 5.08,2.54; 7 7.62,0; 8 7.62,2.54; 9 10.16,0; 10 10.16,2.54; 11 12.7,0; 12 12.7,2.54; 13 15.24,0; 14 15.24,2.54; 15 17.78,0; 16 17.78,2.54; 17 20.32,0; 18 20.32,2.54; 19 22.86,0; 20 22.86,2.54; 21 25.4,0; 22 25.4,2.54; 23 27.94,0; 24 27.94,2.54
LED-0603 = smd 1 x 1: A -0.877,0; C 0.877,0
DIL06 = drill 0.813 offset: 1 -2.54,-3.81; 2 0,-3.81; 3 2.54,-3.81; 4 2.54,3.81; 5 0,3.81; 6 -2.54,3.81
SOT323 = smd 0.7 x 0.7: 1 -0.65,-0.925; 2 0.65,-0.925; 3 0,0.925
TACTILE_SWITCH_PTH_RIGHT_ANGLE_KIT = drill 0.8 pad 1.7: 1 -2.5,0; 2 2.5,0 | drill 1.2 pad 2.2: ANCHOR1 -3.5,2.5; ANCHOR2 3.5,2.5
TO220BV = drill 1.016 long: G 2.54,-2.54; T1 -2.54,-2.54; T2 0,-2.54
TQFP-48 = smd 1.5 x 0.28: 1 -4.25,2.75; 2 -4.25,2.25; 3 -4.25,1.75; 4 -4.25,1.25; 5 -4.25,0.75; 6 -4.25,0.25; 7 -4.25,-0.25; 8 -4.25,-0.75; 9 -4.25,-1.25; 10 -4.25,-1.75; 11 -4.25,-2.25; 12 -4.25,-2.75; 25 4.25,-2.75; 26 4.25,-2.25; 27 4.25,-1.75; 28 4.25,-1.25; 29 4.25,-0.75; 30 4.25,-0.25; 31 4.25,0.25; 32 4.25,0.75; 33 4.25,1.25; 34 4.25,1.75; 35 4.25,2.25; 36 4.25,2.75 | smd 0.28 x 1.5: 13 -2.75,-4.25; 14 -2.25,-4.25; 15 -1.75,-4.25; 16 -1.25,-4.25; 17 -0.75,-4.25; 18 -0.25,-4.25; 19 0.25,-4.25; 20 0.75,-4.25; 21 1.25,-4.25; 22 1.75,-4.25; 23 2.25,-4.25; 24 2.75,-4.25; 37 2.75,4.25; 38 2.25,4.25; 39 1.75,4.25; 40 1.25,4.25; 41 0.75,4.25; 42 0.25,4.25; 43 -0.25,4.25; 44 -0.75,4.25; 45 -1.25,4.25; 46 -1.75,4.25; 47 -2.25,4.25; 48 -2.75,4.25
SOT23-5 = smd 0.55 x 1.2: 1 -0.95,-1.3; 2 0,-1.3; 3 0.95,-1.3; 4 0.95,1.3; 5 -0.95,1.3
SO08 = smd 0.6 x 1.2: 1 -1.905,-2.8; 2 -0.635,-2.8; 3 0.635,-2.8; 4 1.905,-2.8; 5 1.905,2.8; 6 0.635,2.8; 7 -0.635,2.8; 8 -1.905,2.8
IRM-01-5 = drill 0.7 square: +VO 30.734,-11.176; -VO 30.734,-3.556; AC/L 2.794,-18.796; AC/N 2.794,-3.556
CRYSTAL-SMD-3.2X1.5MM = smd 1 x 1.8: P$1 -1.25,0; P$2 1.25,0

### Placement (x,y rotation side)
AC-HOT  6.22,14.61 180 top
AC-NTL  6.22,6.35 180 top
C1  7.62,52.7 0 top
C2  7.62,56.52 0 top
C3  24.51,50.93 90 top
C4  12.32,59.18 90 top
C5  16.89,65.91 90 top
C6  31.11,60.96 180 top
C7  1.91,38.1 270 top
C8  9.53,38.1 270 top
C9  125.73,13.97 180 top
C10  110.49,13.97 180 top
C11  95.25,13.97 180 top
C12  80.01,13.97 180 top
C13  80.01,57.15 180 top
C14  95.25,57.15 180 top
C15  110.49,57.15 180 top
C16  125.73,57.15 180 top
D1  8.26,66.04 180 top
F1  3.81,68.58 180 top
FB1  21.46,50.93 270 top
FRAME1  49.53,85.85 0 top  (outside the outline)
FRAME2  134.37,5.08 180 top
FRAME3  -7.62,-20.32 0 top  (outside the outline)
H1  139.7,65.79 0 top
H2  46.74,65.79 0 top
H3  139.7,5.33 0 top
H4  46.74,5.33 0 top
H5  29.21,50.8 0 top
J1  1.91,62.23 0 top
J2  39.37,64.64 90 top
LCD_CONN  37.21,46.23 270 top
LED_PWR  7.62,34.29 0 top
OPT0  61.21,5.33 270 top
OPT1  61.21,13.97 270 top
OPT2  61.21,22.61 270 top
OPT3  61.21,31.24 270 top
OPT4  61.21,39.88 270 top
OPT5  61.21,48.51 270 top
OPT6  61.21,57.15 270 top
OPT7  61.21,65.79 270 top
Q1  49.28,58.17 270 top
Q2  49.28,53.85 270 top
Q3  49.28,49.53 270 top
Q4  49.28,29.46 270 top
Q5  49.28,25.4 270 top
Q6  49.28,21.34 270 top
Q7  49.28,17.27 270 top
Q8  49.28,13.21 270 top
R0-IN  132.08,64.77 270 top
R0-OUT  125.73,64.77 270 top
R1  6.99,47.62 270 top
R1-IN  116.84,64.77 270 top
R1-OUT  110.49,64.77 270 top
R2  12.19,69.22 180 top
R2-IN  101.6,64.77 270 top
R2-OUT  95.25,64.77 270 top
R3  12.19,66.04 0 top
R3-IN  86.36,64.77 270 top
R3-OUT  80.01,64.77 270 top
R4  3.17,34.29 180 top
R4-IN  86.36,6.35 270 top
R4-OUT  80.01,6.35 270 top
R5  54.1,64.77 90 top
R5-IN  101.6,6.35 270 top
R5-OUT  95.25,6.35 270 top
R6  134.37,36.83 90 top
R6-IN  116.84,6.35 270 top
R6-OUT  110.49,6.35 270 top
R7  69.85,68.33 0 top
R7-IN  132.08,6.35 270 top
R7-OUT  125.73,6.35 270 top
R8  132.08,13.97 0 top
R9  52.07,66.8 90 top
R10  54.1,56.13 90 top
R11  114.05,36.83 90 top
R12  69.85,59.69 0 top
R13  116.84,13.97 0 top
R14  52.07,58.17 90 top
R15  54.1,47.5 90 top
R16  93.73,36.83 90 top
R17  69.85,51.05 0 top
R18  101.6,13.97 0 top
R19  52.07,49.53 90 top
R20  54.1,38.86 90 top
R21  72.39,36.83 90 top
R22  69.85,42.42 0 top
R23  86.36,13.97 0 top
R24  52.07,40.89 90 top
R25  54.1,30.23 90 top
R26  90.42,36.83 90 top
R27  69.85,33.78 0 top
R28  86.36,57.15 0 top
R29  52.07,32.26 90 top
R30  54.1,21.59 90 top
R31  110.74,36.83 90 top
R32  69.85,25.15 0 top
R33  101.6,57.15 0 top
R34  52.07,23.62 90 top
R35  54.1,12.95 90 top
R36  131.06,36.83 90 top
R37  69.85,16.51 0 top
R38  116.84,57.15 0 top
R39  52.07,14.99 90 top
R40  54.1,4.57 90 top
R41  143.51,36.83 90 top
R42  69.85,7.87 0 top
R43  132.08,57.15 0 top
R44  52.07,6.35 90 top
R45  45.97,58.67 0 top
R46  45.97,56.39 0 top
R47  45.97,54.36 0 top
R48  45.97,52.32 0 top
R49  45.97,50.29 0 top
R50  45.97,48.26 0 top
R51  45.97,30.23 0 top
R52  45.97,28.19 0 top
R53  45.97,26.16 0 top
R54  45.97,24.13 0 top
R55  45.97,22.1 0 top
R56  45.97,20.07 0 top
R57  45.97,18.03 0 top
R58  45.97,16 0 top
R59  45.97,13.97 0 top
R60  45.97,11.94 0 top
R61  16.51,53.59 90 top
R62  12.45,44.45 180 top
R_0  52.07,2.79 270 top
R_1  52.07,11.43 270 top
R_2  52.07,20.07 270 top
R_3  52.07,28.7 270 top
R_4  52.07,37.34 270 top
R_5  52.07,45.97 270 top
R_6  52.07,54.61 270 top
R_7  52.07,63.25 270 top
S1  2.54,47.62 270 top
T0  149.86,36.83 270 top
T1  129.54,36.83 270 top
T2  109.22,36.83 270 top
T3  88.9,36.83 270 top
T4  78.74,36.83 270 top
T5  99.06,36.83 270 top
T6  119.38,36.83 270 top
T7  139.7,36.83 270 top
U1  22.86,61.59 90 top
U2  5.71,38.1 270 top
U3  13.46,49.02 270 top
U$1  11.68,3.56 90 top
Y1  10.79,54.61 90 top

### Tracks (layer width: path | path; a pad name or v marks a point on that pad's centre or on a via)
3.3V  (via drill 0.5)
  Top 0.254: v8.64,46.74 8.6,46.77 R1.2 | v25.02,60.83 27.1,60.83 U1.17 28.4,60.84 28.52,60.96 C6.2 | U1.44 14.74,60.84 v14.35,60.45 | U1.36 20.11,66.76 19.68,67.18 17.31,67.18 C5.2 16.6,66.76 v15.75,65.91 | LCD_CONN.23 32.77,18.29 22.86,28.19 8.42,28.19 R4.2 | v8.64,46.74 8.64,48.9 U3.1 | U3.1 U3.2 | U3.1 U3.3 | U3.1 U3.8 15.62,50.93 14.48,52.07 14.48,52.41 R61.2 | R62.2 10.92,44.45 v8.64,46.74
  Top 0.406: 8.13,38.95 C8.1 | 8.13,38.95 7.01,38.95 U2.5 6.99,39.05 6.99,41.66 | R1.2 6.99,41.66 | R4.2 2.41,34.29 2.41,35.18 2.92,35.69 7.49,35.69 8.13,36.32 8.13,38.95 | FB1.2 21.59,49.95 21.25,49.95 12.95,41.66 6.99,41.66
  Bottom 0.254: v14.35,60.45 13.72,60.45 8.64,55.37 v8.64,46.74 | J2.1 40.01,62.22 40.82,63.04 40.82,67.64 38.86,69.6 | v25.02,60.83 25.15,60.96 25.15,62.74 24.52,63.37 24.52,63.5 24.51,63.5 23.82,63.5 23.37,63.95 23.37,64.58 23.62,64.83 23.62,67.06 21.84,68.83 21.21,68.83
  Bottom 0.406: 38.86,69.6 21.84,69.6 21.21,68.96 21.21,68.83 16.26,68.83 15.75,68.2 v15.75,65.91 15.75,65.31 16.45,64.61 16.45,63.92 15.75,63.21 15.75,61.85 v14.35,60.45
5V  (via drill 0.5, 0.6)
  Top 0.254: R9.2 53.09,66.64 53.09,64.94 R5.1 | R14.2 53.09,58 53.09,56.3 R10.1 | R19.2 53.09,49.36 53.09,47.66 R15.1 | R24.2 53.09,40.73 53.09,39.03 R20.1 | R44.2 53.09,6.18 53.09,4.74 R40.1 | R39.2 53.09,14.82 53.09,13.12 R35.1 | R34.2 53.09,23.46 53.09,21.76 R30.1 | R29.2 53.09,32.09 53.09,30.39 R25.1 | U$1.+VO 23.62,34.04
  Top 0.406: C7.1 2,39.05 3.17,39.05 | 3.17,39.05 U2.1 4.74,38.99 5.33,38.99 5.71,38.61 5.71,37.47 5.4,37.15 U2.3 | v3.17,40.64 3.17,39.05 | D1.3 9.06,64.14 v9.53,64.14 | v11.43,40.64 17.53,40.64 22.86,35.31 U$1.+VO | v53.98,67.94 52.36,67.94 R9.2 | v53.98,59.69 52.74,59.69 R14.2 | v53.98,50.8 52.49,50.8 R19.2 | v53.98,42.55 52.87,42.55 R24.2 | v53.98,33.66 52.62,33.66 R29.2 | v53.98,24.77 52.36,24.77 R34.2 | v53.98,16.51 52.74,16.51 R39.2 | v53.98,7.62 52.49,7.62 R44.2
  Top 0.61: LCD_CONN.21 31.5,20.83 23.11,29.21 23.11,31.5 23.62,32 23.62,34.04
  Bottom 0.406: 6.99,40.64 v3.17,40.64 | v9.53,64.14 6.99,61.59 6.99,40.64 | 6.99,40.64 v11.43,40.64
  Bottom 0.61: v53.98,7.62 v53.98,16.51 53.98,19.05 | 53.98,19.05 v53.98,24.77 v53.98,33.66 v53.98,42.55 v53.98,50.8 v53.98,59.69 v53.98,67.94 | LCD_CONN.21 36.32,20.83 34.54,19.05 34.54,18.29 36.32,16.51 40.39,16.51 42.93,19.05 53.98,19.05
!RESET  (via drill 0.5)
  Top 0.254: U1.40 18.59,62.87 15.37,62.87 v14.86,63.37 13.59,63.37 12.32,62.23 11.3,62.23 8.76,59.69 8.76,59.05 8.13,58.42 6.48,58.42 2.54,54.48 S1.1 | J2.10 35.31,67.18 32.89,69.6 15.11,69.6 v14.86,69.34
  Top 0.406: S1.1 4.19,48.48 R1.1
  Bottom 0.254: v14.86,69.34 v14.86,63.37
BTN_B0
  Top 0.254: U1.25 27.88,65.84 28.73,65 33.71,65 35.41,63.29 35.41,48.66 36.58,47.5 37.85,47.5 39.12,46.23 LCD_CONN.2
BTN_B1
  Top 0.254: U1.26 25.16,65.9 25.16,66.72 25.34,66.9 27.44,66.9 28.91,65.43 33.88,65.43 35.93,63.39 35.93,48.91 36.83,48.01 39.88,48.01 41.15,46.74 41.15,45.09 LCD_CONN.4
BTN_B2
  Top 0.254: U1.27 24.66,65.9 24.66,66.83 25.16,67.33 27.62,67.33 29.09,65.86 34.06,65.86 36.36,63.57 36.36,49.24 37.08,48.51 40.13,48.51 41.66,46.99 41.66,44.96 41.15,44.45 41.15,42.55 LCD_CONN.6
BTN_B3
  Top 0.254: U1.28 24.16,65.9 24.16,66.94 24.99,67.76 27.8,67.76 29.26,66.29 34.24,66.29 36.92,63.62 36.92,49.44 37.34,49.02 40.39,49.02 42.16,47.24 42.16,44.7 41.66,44.2 41.66,42.42 41.15,41.91 41.15,40.01 LCD_CONN.8
BTN_B4
  Top 0.254: U1.29 23.66,65.9 23.66,67.05 24.81,68.19 27.97,68.19 29.44,66.73 34.42,66.73 37.35,63.8 37.35,49.77 37.59,49.53 40.64,49.53 42.67,47.5 42.67,44.45 42.16,43.94 42.16,42.16 41.66,41.66 41.66,39.62 41.15,39.12 41.15,37.47 LCD_CONN.10
BTN_CTL  (via drill 0.5)
  Top 0.254: U1.30 23.16,65.9 23.16,67.16 24.63,68.63 28.15,68.63 29.62,67.16 34.6,67.16 37.78,63.97 37.78,50.8 38.29,50.29 v39.88,50.29 | LCD_CONN.12 39.75,33.91 41.15,35.31 41.15,36.83 41.66,37.34 41.66,38.86 42.16,39.37 42.16,41.4 42.67,41.91 42.67,42.67 v44.2,44.2
  Bottom 0.254: v44.2,44.2 44.2,45.97 v39.88,50.29
GND  (via drill 0.5)
  Top 0.254: J1.GND 4.66,60.96 5.84,60.96 | R3.1 6.22,66.04
  other vias: 16.76,58.04 12.19,49.66 10.41,67.56 18.16,41.78 18.67,66.04 18.29,67.94 28.57,40.26 43.18,68.07 45.47,36.58 42.42,21.84 42.93,3.81 50.29,51.56 51.56,43.43 50.29,55.88 31.88,46.35 3.05,30.48 17.27,38.35
  pour Top: 0,71.12 0,27.94 22.86,27.94 40.64,10.16 40.64,0 58.55,0 58.55,71.12
  pour Bottom: 0,71.12 0,27.94 22.86,27.94 40.64,10.16 40.64,0 58.55,0 58.55,71.12
LCD_CS1_LV  (via drill 0.5)
  Top 0.254: U1.37 18.65,64.39 v20.32,64.39 | v34.54,34.04 34.54,34.54 32.26,36.83 32.26,44.45 30.23,46.48 v25.4,46.48
  Bottom 0.254: v20.32,64.39 18.03,62.1 18.03,49.53 22.1,45.47 24.38,45.47 v25.4,46.48 | LCD_CONN.14 39.62,30.99 38.35,32.26 36.58,32.26 35.56,33.27 35.31,33.27 v34.54,34.04
LCD_CS2_LV  (via drill 0.5)
  Top 0.254: U1.38 18.65,63.88 19.56,63.88 19.94,63.5 v20.95,63.5 21.08,63.5 | v33.53,32.26 32.51,33.27 32.51,35.05 31.24,36.32 31.24,43.69 30.73,44.2 25.4,44.2 v23.37,46.23
  Bottom 0.254: v20.95,63.5 18.54,60.96 18.54,50.29 22.61,46.23 v23.37,46.23 | LCD_CONN.16 39.75,28.57 38.61,29.72 36.58,29.72 35.81,30.48 35.81,31.5 36.07,31.75 36.07,32 35.31,32.77 34.04,32.77 v33.53,32.26
LCD_D0_LV
  Top 0.254: LCD_CONN.7 35.81,38.61 33.68,40.74 33.68,51.41 | 28.84,62.91 28.85,62.91 28.86,62.92 28.88,62.91 29.23,63.26 33,63.26 33.68,62.58 33.68,51.41 | 28.84,62.91 | 28.84,62.91 | 28.84,62.91 28.83,62.9 28.82,62.9 | 28.82,62.9 | 28.82,62.9 28.81,62.9 28.8,62.89 27.27,62.89 27.22,62.84 U1.21 | 28.82,62.9 | 28.82,62.9 | 33.68,51.41
LCD_D1_LV
  Top 0.254: LCD_CONN.5 35.81,41.15 34.12,42.85 34.12,51.23 | 34.12,51.23 | 28.71,63.36 28.72,63.36 29.05,63.7 33.18,63.7 34.12,62.76 34.12,51.23 | 28.71,63.36 | 28.71,63.36 28.7,63.35 28.68,63.35 | 28.68,63.35 | 28.68,63.35 | 28.68,63.35 | 28.68,63.35 | 28.68,63.35 28.67,63.35 28.67,63.34 28.66,63.34 | 28.66,63.34 | U1.22 27.13,63.34 28.66,63.34
LCD_D2_LV
  Top 0.254: LCD_CONN.3 35.94,43.69 34.55,45.08 34.55,51.05 | 34.55,51.05 | 34.55,51.05 34.55,62.94 33.36,64.13 31.38,64.13 31.37,64.14 28.88,64.14 28.62,63.87 28.6,63.85 27.12,63.85 U1.23
LCD_D3_LV
  Top 0.254: LCD_CONN.1 37.08,46.23 34.98,48.33 34.98,50.87 | 34.98,50.87 | 34.98,50.87 34.98,63.12 33.53,64.57 28.7,64.57 28.42,64.29 27.99,64.29 27.16,64.29 U1.24
LCD_D4_LV
  Top 0.254: LCD_CONN.15 27.81,28.45 26.08,30.18 26.08,35.56 21.84,39.79 21.84,47.75 23.23,49.14 25.32,49.14 25.32,53.02 23.16,55.17 23.16,56.23 | U1.7 23.16,57.29 23.16,56.23 | 23.16,56.23
LCD_D5_LV
  Top 0.254: LCD_CONN.13 27.43,30.99 26.51,31.91 26.51,35.97 22.35,40.13 22.35,47.5 23.37,48.51 25.65,48.51 25.91,48.77 25.91,53.59 25.4,53.59 23.62,55.37 23.62,57.33 U1.8
LCD_D6_LV
  Top 0.254: LCD_CONN.11 36.32,33.53 32.82,37.03 32.82,62.22 32.64,62.4 29.59,62.4 29.22,62.03 29.16,62.03 29.15,62.03 28.95,61.84 U1.19
LCD_D7_LV
  Top 0.254: LCD_CONN.9 34.39,36.07 33.25,37.21 33.25,62.4 32.82,62.83 29.41,62.83 29.05,62.47 29,62.47 | 29,62.47 | 29,62.47 | 29,62.47 28.99,62.47 28.98,62.47 28.98,62.46 28.97,62.46 28.85,62.34 U1.20
LCD_DI_LV  (via drill 0.5)
  Top 0.254: U1.47 18.61,59.31 v14.35,59.31 | LCD_CONN.19 30.48,23.37 v24.38,29.46
  Bottom 0.254: v14.35,59.31 14.35,38.23 23.11,29.46 v24.38,29.46
LCD_EN_LV  (via drill 0.5)
  Top 0.254: U1.39 18.64,63.37 19.43,63.37 20.07,62.74 v21.97,62.74 | v34.8,31.75 34.8,32.26 33.27,33.78 33.27,35.05 31.75,36.58 31.75,43.94 30.99,44.7 25.91,44.7 24.38,46.23 v24.38,47.24
  Bottom 0.254: v21.97,62.74 19.05,59.82 19.05,50.8 22.61,47.24 v24.38,47.24 | LCD_CONN.18 39.75,26.04 38.61,27.18 36.32,27.18 35.81,27.69 35.81,29.46 34.8,30.48 v34.8,31.75
LCD_LIGHT  (via drill 0.5)
  Top 0.254: U1.16 25.93,60.34 25.4,59.82 v24.64,59.82
  Bottom 0.254: LCD_CONN.20 41.27,24.89 41.27,34.29 40.77,34.8 31.24,34.8 27.3,38.73 27.3,47.62 26.04,48.9 26.04,53.34 24.64,54.74 v24.64,59.82
LCD_RW_LV  (via drill 0.5)
  Top 0.254: 18.57,58.8 U1.48 15.79,58.84 v15.24,58.29 | LCD_CONN.17 29.21,25.91 25.4,29.72 25.4,30.23 v24.64,30.99
  Bottom 0.254: v15.24,58.29 15.24,38.35 22.61,30.99 v24.64,30.99
MODE  (via drill 0.5)
  Top 0.254: U1.15 26.06,59.84 25.91,59.69 25.91,59.05 v25.65,58.8
  Bottom 0.254: LCD_CONN.22 39.88,20.83 42.04,22.99 42.04,36.45 41.15,37.34 29.72,37.34 27.81,39.24 27.81,46.86 28.19,47.24 30.86,47.24 32.89,49.28 32.89,51.94 30.61,54.23 26.29,54.23 25.27,55.24 25.27,58.42 v25.65,58.8
N$1
  Top 0.254: C2.2 9.12,55.86 Y1.P$2 12.15,57.09 19.86,57.09 U1.1
  Top 0.406: C2.2 8.53,56.46
N$2
  Top 0.254: U1.2 20.57,57.31 20.57,56.13 20.07,55.63 14.73,55.63 12.47,53.36 Y1.P$1 10.14,52.7 C1.2
N$3
  Top 0.254: U1.6 22.61,55.12 24.51,53.21 C3.2 24.51,51.18 24.38,51.05 21.59,51.05 21.46,51.18 FB1.1
N$4
  Top 0.254: U1.43 13.63,61.34 C4.2
N$5
  Top 0.406: J1.VBUS 4.66,63.5 5.71,63.5 5.71,66.04 5.08,66.67 3.81,66.67 2.41,68.08 F1.2
N$6
  Bottom 1.676: U$1.AC/N AC-NTL.A1
  Bottom 1.778: AC-NTL.A1 AC-NTL.A2
N$7
  Bottom 1.676: AC-HOT.A1 23.24,14.61 U$1.AC/L
  Bottom 1.778: 8.89,14.61 AC-HOT.A1 AC-HOT.A2
N$8
  Top 0.254: R5.2 56.81,68.33 OPT7.1
N$9
  Top 0.406: R4.1 LED_PWR.A
N$10
  Top 0.61: OPT7.4 69.85,63.25 72.39,60.71 72.39,54.86 76.45,50.8 91.95,50.8 96.27,46.48 125.48,46.48 | 125.48,46.48 125.98,46.48 | T7.G 136.06,34.29 R6.1 133.7,36.65 133.67,36.65 132.59,37.73 132.59,39.88 125.98,46.48 | 125.48,46.48 125.98,46.48
N$11
  Top 1.016: OPT7.6 R7.1
N$12
  Top 0.61: T7.T2 138.94,36.83 139.7,37.59 139.7,41.4 133.35,47.75 97.03,47.75 92.71,52.07 76.96,52.07 73.66,55.37 73.66,65.37 R7.2
  Top 1.016: R8.2 132.93,9.85 R7-IN.A1
  Bottom 1.676: T7.T2 139.7,36.83 142.24,34.29 142.24,31.75
  Bottom 3.81: R7-IN.A2 R7-IN.A1 132.08,21.59 142.24,31.75
N$13
  Top 1.016: C9.1 R8.1
N$14
  Top 0.61: T7.T1 136.06,39.37 R6.2
  Top 1.016: C9.2 124.33,10.4 R7-OUT.A1
  Bottom 1.676: T7.T1 135.89,39.37 132.08,35.56 132.08,31.75
  Bottom 3.81: R7-OUT.A2 R7-OUT.A1 125.73,25.4 132.08,31.75
N$15
  Top 0.254: R46.2 R45.2 48.24,58.67 Q1.1
N$16
  Top 0.406: R9.1 R_7.A
N$17
  Top 0.254: F1.1 5.84,69.22 9.14,69.22 | 9.14,69.22 R2.2 | D1.1 9.14,67.1 9.14,69.22
N$18
  Top 0.254: R10.2 56.81,59.69 OPT6.1
N$19
  Top 0.61: OPT6.4 69.09,54.61 75.18,48.51 90.93,48.51 95.25,44.2 107.7,44.2 112.27,39.62 112.27,37.73 113.35,36.65 113.38,36.65 R11.1 115.74,34.29 T6.G
N$20
  Top 1.016: OPT6.6 R12.1
N$21
  Top 0.61: T6.T2 118.62,36.83 119.38,37.59 119.38,41.4 115.32,45.47 95.76,45.47 91.44,49.78 75.69,49.78 70.7,54.78 R12.2
  Top 1.016: R13.2 117.69,9.85 R6-IN.A1
  Bottom 1.676: T6.T2 119.38,36.83 121.92,34.29 121.92,31.75
  Bottom 3.81: R6-IN.A2 R6-IN.A1 116.84,26.67 121.92,31.75
N$22
  Top 1.016: C10.1 R13.1
N$23
  Top 0.61: T6.T1 115.74,39.37 R11.2
  Top 1.016: C10.2 109.09,10.4 R6-OUT.A1
  Bottom 1.676: T6.T1 115.57,39.37 111.76,35.56 111.76,31.75
  Bottom 3.81: R6-OUT.A2 R6-OUT.A1 110.49,30.48 111.76,31.75
N$24
  Top 0.406: R14.1 R_6.A
N$25
  Top 0.254: R15.2 56.81,51.05 OPT5.1
N$26
  Top 0.61: T5.G 95.42,34.29 R16.1 93.06,36.65 93.03,36.65 91.69,37.98 91.69,40.64 86.36,45.97 OPT5.4
N$27
  Top 1.016: OPT5.6 R17.1
N$28
  Top 0.61: T5.T2 98.3,36.83 99.06,37.59 99.06,41.4 98.04,42.42 95,42.42 90.17,47.24 74.51,47.24 R17.2
  Top 1.016: R18.2 102.45,9.85 R5-IN.A1
  Bottom 1.676: T5.T2 99.06,36.83 101.6,34.29 101.6,31.75
  Bottom 3.81: R5-IN.A2 R5-IN.A1 101.6,31.75
N$29
  Top 1.016: C11.1 R18.1
N$30
  Top 0.61: T5.T1 95.42,39.37 R16.2
  Top 1.016: C11.2 93.85,10.4 R5-OUT.A1
  Bottom 1.676: T5.T1 95.25,39.37 91.44,35.56 91.44,31.75
  Bottom 3.81: R5-OUT.A2 R5-OUT.A1 91.44,12.81 91.44,31.75
N$31
  Top 0.406: R19.1 R_5.A
N$32
  Top 0.254: R20.2 56.81,42.42 OPT4.1
N$33
  Top 0.61: OPT4.4 70.71,37.34 71.61,36.44
  Top 1.016: T4.G 74.08,34.29 R21.1 71.93,36.44 71.61,36.44
N$34
  Top 1.016: OPT4.6 R22.1
N$35
  Top 0.61: R22.2 77.72,42.42 78.49,41.66 78.49,37.34 77.98,36.83 T4.T2
  Top 1.016: R23.2 87.21,9.85 R4-IN.A1
  Bottom 1.676: T4.T2 78.74,36.83 80.01,35.56
  Bottom 3.81: R4-IN.A1 R4-IN.A2 | R4-IN.A1 86.36,10.16 | 80.01,35.56 81.28,34.29 81.28,20.32 86.36,15.24 R4-IN.A1
N$36
  Top 1.016: C12.1 R23.1
N$37
  Top 1.016: R21.2 74.08,39.37 T4.T1 | C12.2 78.61,10.4 R4-OUT.A1
  Bottom 1.676: T4.T1 72.39,39.37
  Bottom 3.81: R4-OUT.A2 R4-OUT.A1 78.63,9 69.85,17.78 69.85,36.83 72.39,39.37
N$38
  Top 0.406: R24.1 R_4.A
N$39
  Top 0.254: R25.2 56.81,33.78 OPT3.1
N$40
  Top 0.61: R26.1 88.73,34.29 T3.G 82.3,30.23 73.41,30.23 71.88,28.7 OPT3.4
N$41
  Top 1.016: OPT3.6 R27.1
N$42
  Top 0.61: R27.2 71.37,33.78 73.41,31.75 78.49,31.75 83.57,36.83 T3.T2
  Top 1.016: R28.2 87.21,61.27 R3-IN.A2
  Bottom 1.676: T3.T2 87.63,36.83 91.44,40.64 91.44,41.91
  Bottom 3.81: R3-IN.A1 R3-IN.A2 86.36,46.99 91.44,41.91
N$43
  Top 1.016: C13.1 R28.1
N$44
  Top 0.254: R48.2 R47.2 46.94,54.5 Q2.1
N$45
  Top 0.406: R_3.A R29.1
N$46
  Top 0.254: R30.2 56.81,25.15 OPT2.1
N$47
  Top 0.61: R31.1 109.05,34.29 T2.G 100.08,27.69 75.95,27.69 68.33,20.07 OPT2.4
N$48
  Top 1.016: OPT2.6 R32.1
N$49
  Top 0.61: R32.2 70.7,25.23 74.42,28.96 95.5,28.96 103.38,36.83 T2.T2
  Top 1.016: R33.2 102.45,61.27 R2-IN.A2
  Bottom 1.676: T2.T2 107.95,36.83 111.76,40.64 111.76,41.91
  Bottom 3.81: R2-IN.A1 R2-IN.A2 101.6,52.07 111.76,41.91
N$50
  Top 1.016: C14.1 R33.1
N$51
  Top 0.61: T2.T1 109.05,39.37 R31.2
  Top 1.016: C14.2 93.85,60.72 R2-OUT.A2
  Bottom 1.676: T2.T1 105.41,39.37 102.87,41.91
  Bottom 3.81: R2-OUT.A1 R2-OUT.A2 95.25,49.53 102.87,41.91
N$52
  Top 0.406: R34.1 R_2.A
N$53
  Top 0.254: R35.2 56.81,16.51 OPT1.1
N$54
  Top 0.61: R36.1 129.37,34.29 T1.G 121.67,28.96 105.66,28.96 101.6,24.89 81.53,24.89 68.07,11.43 OPT1.4
N$55
  Top 1.016: OPT1.6 R37.1
N$56
  Top 0.61: R37.2 70.7,16.85 80.26,26.42 101.09,26.42 104.9,30.23 117.6,30.23 124.21,36.83 T1.T2
  Top 1.016: R38.2 117.69,61.27 R1-IN.A2
  Bottom 1.676: T1.T2 128.27,36.83 132.08,40.64 132.08,41.91
  Bottom 3.81: R1-IN.A2 R1-IN.A1 | R1-IN.A2 116.84,59.69 | R1-IN.A2 116.84,57.15 132.08,41.91
N$57
  Top 1.016: C15.1 R38.1
N$58
  Top 0.61: T1.T1 129.37,39.37 R36.2
  Top 1.016: C15.2 109.09,60.72 R1-OUT.A2
  Bottom 1.676: T1.T1 125.73,39.37 123.19,41.91
  Bottom 3.81: R1-OUT.A1 R1-OUT.A2 110.49,53.34 121.92,41.91 123.19,41.91
N$59
  Top 0.406: R39.1 R_1.A
N$60
  Top 0.254: R40.2 56.55,7.87 OPT0.1
N$61
  Top 0.61: R41.1 145.2,34.29 T0.G 141.99,28.96 125.73,28.96 123.19,26.42 106.68,26.42 102.36,22.1 82.8,22.1 75.18,14.48 75.18,9.14 68.83,2.79 OPT0.4
N$62
  Top 1.016: OPT0.6 R42.1
N$63
  Top 0.61: R42.2 70.7,12.28 82.04,23.62 102.11,23.62 106.17,27.69 122.68,27.69 125.22,30.23 139.7,30.23 141.99,32.51 141.99,39.62 144.53,42.16 148.84,42.16 149.61,41.4 149.61,38.1 148.34,36.83 T0.T2
  Top 1.016: R43.2 132.93,61.27 R0-IN.A2
  Bottom 1.676: T0.T2 148.59,36.83 149.86,38.1 149.86,41.91 148.59,43.18
  Bottom 3.81: R0-IN.A1 R0-IN.A2 132.08,60.96 148.59,44.45 148.59,43.18
N$64
  Top 1.016: C16.1 R43.1
N$65
  Top 0.61: T0.T1 145.2,39.37 R41.2
  Top 1.016: C16.2 124.33,60.72 R0-OUT.A2
  Bottom 1.676: T0.T1 146.05,39.37 143.51,41.91
  Bottom 3.81: R0-OUT.A2 R0-OUT.A1 | R0-OUT.A2 125.73,59.69 | 143.51,41.91 140.97,41.91 125.73,57.15 R0-OUT.A2
N$66
  Top 0.406: R44.1 R_0.A
N$67
  Top 0.254: R50.2 R49.2 46.94,50.18 Q3.1
N$68
  Top 0.254: R52.2 R51.2 46.94,30.11 Q4.1
N$69
  Top 0.254: R54.2 R53.2 48.24,26.16 Q5.1
N$70
  Top 0.254: R56.2 R55.2 46.94,21.99 Q6.1
N$71
  Top 0.254: R58.2 46.82,17.53 | 46.82,17.53 R57.2 | Q7.1 47.22,17.92 46.82,17.53
N$72
  Top 0.254: R60.2 R59.2 46.94,13.86 Q8.1
R3-OUT
  Top 0.61: T3.T1 88.73,39.37 R26.2
  Top 1.016: C13.2 78.61,60.72 R3-OUT.A2
  Bottom 1.676: T3.T1 85.09,39.37 80.01,44.45
  Bottom 3.81: R3-OUT.A1 R3-OUT.A2 80.01,44.45 81.28,43.18
RCTL0_HV
  Top 0.254: OPT0.2 58.42,4.32 58.42,1.91 58.04,1.52 52.45,1.52 52.07,1.91 R_0.C 50.2,3.79 Q8.3
RCTL0_LV  (via drill 0.5)
  Top 0.254: U1.3 21.08,57.32 v21.08,53.59 | R59.1 v43.43,13.97
  Bottom 0.254: v43.43,13.97 43.43,10.92 42.67,10.16 40.89,10.16 24.89,26.16 24.89,28.45 25.4,28.96 25.4,45.21 26.16,45.97 26.16,46.99 21.08,52.07 v21.08,53.59
RCTL1_HV
  Top 0.254: OPT1.2 58.42,12.95 58.42,10.79 57.78,10.16 52.7,10.16 52.31,10.55 R_1.C 51.68,10.55 51.05,11.18 51.05,16.42 Q7.3
RCTL1_LV  (via drill 0.5)
  Top 0.254: v22.61,53.09 21.61,54.84 U1.4 | R57.1 v43.56,18.03
  Bottom 0.254: v43.56,18.03 43.56,15.37 40.89,12.7 39.12,12.7 25.91,25.91 25.91,44.96 26.67,45.72 26.67,47.24 21.84,52.07 21.84,52.32 v22.61,53.09
RCTL2_HV
  Top 0.254: OPT2.2 58.42,21.59 58.42,19.05 57.78,18.41 52.7,18.41 52.07,19.05 R_2.C 51.42,19.19 51.05,19.56 51.05,20.48 Q6.3
RCTL2_LV  (via drill 0.5)
  Top 0.254: U1.9 24.13,57.33 24.13,55.88 24.77,55.24 v26.8,55.24 | v38.61,55.24 41.78,55.24 42.16,54.86 42.16,54.36 42.67,53.85 42.67,50.55 43.18,50.04 43.18,46.99 44.7,45.47 48.51,45.47 49.28,44.7 49.28,35.81 48.77,35.31 48.77,33.53 47.5,32.26 44.7,32.26 43.69,31.24 43.69,26.67 44.2,26.16 44.2,23.03 R55.1
  Bottom 0.254: v38.61,55.24 v26.8,55.24
RCTL3_HV
  Top 0.254: OPT3.2 58.42,30.23 58.42,27.94 57.78,27.3 52.7,27.3 52.19,27.82 R_3.C 51.95,27.82 51.05,26.92 51.05,26.25 Q5.3
RCTL3_LV  (via drill 0.5)
  Top 0.254: U1.10 24.64,57.32 24.64,56.13 25.02,55.75 26.16,55.75 26.8,56.39 v27.56,56.39 | v39.12,56.39 42.16,56.39 42.67,55.88 42.67,54.61 43.18,54.1 43.18,50.8 43.69,50.29 43.69,47.24 44.96,45.97 49.02,45.97 49.78,45.21 49.78,35.56 49.28,35.05 49.28,33.27 47.75,31.75 44.96,31.75 44.2,30.99 44.2,27.09 R53.1
  Bottom 0.254: v39.12,56.39 v27.56,56.39
RCTL4_HV
  Top 0.254: OPT4.2 58.42,38.86 58.42,36.83 57.78,36.2 52.7,36.2 52.44,36.46 R_4.C 50.55,34.94 50.55,29.97 50.2,29.63 Q4.3
RCTL4_LV  (via drill 0.5)
  Top 0.254: U1.11 25.11,56.42 25.27,56.26 25.91,56.26 27.05,57.4 v27.94,57.4 | v38.61,57.4 42.93,57.4 43.18,57.15 43.18,54.86 43.69,54.36 43.69,51.05 44.2,50.55 44.2,47.5 45.21,46.48 49.53,46.48 50.29,45.72 50.29,35.31 49.78,34.8 49.78,33.02 48.01,31.24 46.14,31.24 R51.1
  Bottom 0.254: v38.61,57.4 v27.94,57.4
RCTL5_HV
  Top 0.254: OPT5.2 58.42,47.5 58.42,45.09 57.78,44.45 52.7,44.45 52.07,45.09 R_5.C 51.05,46.37 51.05,49.02 50.55,49.53 Q3.3
RCTL5_LV  (via drill 0.5)
  Top 0.254: U1.12 26.56,58.29 v28.83,58.29 | v39.24,58.29 43.56,58.29 43.69,58.17 43.69,55.12 44.2,54.61 44.2,51.22 R49.1
  Bottom 0.254: v39.24,58.29 v28.83,58.29
RCTL6_HV
  Top 0.254: OPT6.2 58.42,56.13 58.42,53.98 57.78,53.34 52.7,53.34 52.31,53.73 R_6.C 51.95,53.85 Q2.3
RCTL6_LV  (via drill 0.5)
  Top 0.254: U1.13 27.15,58.8 28.19,58.8 28.57,59.18 v29.59,59.18 | v38.61,59.18 43.43,59.18 44.2,58.42 44.2,55.28 R47.1 45.12,54.44
  Bottom 0.254: v29.59,59.18 v38.61,59.18
RCTL7_HV
  Top 0.254: OPT7.2 58.42,64.77 58.42,62.23 57.78,61.59 52.7,61.59 52.07,62.23 R_7.C 50.2,60.5 Q1.3
RCTL7_LV  (via drill 0.5)
  Top 0.254: U1.14 27.15,59.31 27.94,59.31 v28.83,60.2 | v39.24,60.2 43.6,60.2 R45.1
  Bottom 0.254: v28.83,60.2 v39.24,60.2
SCL  (via drill 0.5)
  Top 0.254: U1.32 v22.11,64.02 v22.1,64.01 | U3.6 16.93,49.05 16.99,49.05 17.17,49.23 17.17,51.35 16.51,52.01 R61.1 18.38,54.61 v19.81,54.61
  Bottom 0.254: v19.81,54.61 22.1,56.9 22.1,61.79 22.73,62.42 22.73,63.05 22.1,63.68 v22.1,64.01
SDA  (via drill 0.5)
  Top 0.254: R62.1 13.6,44.45 U3.5 16.93,47.78 16.99,47.78 19.8,50.59 v20.33,50.59 | U1.31 22.61,67 v22.35,67.26
  Bottom 0.254: v22.35,67.26 22.35,64.83 22.86,64.32 22.86,63.76 23.88,62.74 23.88,57.46 20.32,53.91 20.32,53.28 20.33,53.27 v20.33,50.59
SWDCLK  (via drill 0.5)
  Top 0.254: U1.45 18.63,60.33 20.83,60.33 24.13,63.63 v24.13,64.26
  Bottom 0.254: v24.13,64.26 28.96,69.09 30.99,69.09 31.48,68.59 31.48,68.57 36.68,63.37 J2.4
SWDIO  (via drill 0.5)
  Top 0.254: U1.46 18.64,59.82 21.08,59.82 25.02,63.75 v25.27,63.75
  Bottom 0.254: v25.27,63.75 25.27,64.14 29.72,68.58 30.86,68.58 37.34,62.1 J2.2
USB_D+
  Top 0.254: J1.D+ 9.65,62.23 11.47,64.05 11.47,64.08 12.19,64.8 13.9,64.8 14.33,65.23 14.33,66.14 16.92,68.73 19.66,68.73 21.08,67.31 21.08,65.87 U1.34 21.11,66.52
USB_D-
  Top 0.254: U1.33 21.59,65.86 21.59,67.56 19.99,69.16 16.64,69.16 13.9,66.42 13.9,65.41 13.72,65.23 12.01,65.23 9.65,62.88 J1.D-
USB_SENSE  (via drill 0.5 pad 0.25)
  Top 0.254: 18.6,62.36 U1.41 14.36,62.34 v13.97,62.61 | v14.1,67.69 13.04,67.69
  Top 0.406: R2.1 13.04,67.69 R3.2
  Bottom 0.254: v14.1,67.69 v13.97,62.61

### Text on the board
tPlace: RST | HIGH VOLTAGE | CAUTION! HOT! | HIGH | VOLTAGE | HIGH VOLTAGE | CAUTION! HOT!
bPlace: Solid-State Timer v1.5 (Rev. 3) | Relay Controller Plate | ME Team 9 | EE Team 1721 | 2017-04-19